# Altium project ZynTra.PrjPcb (part 1 of 2)
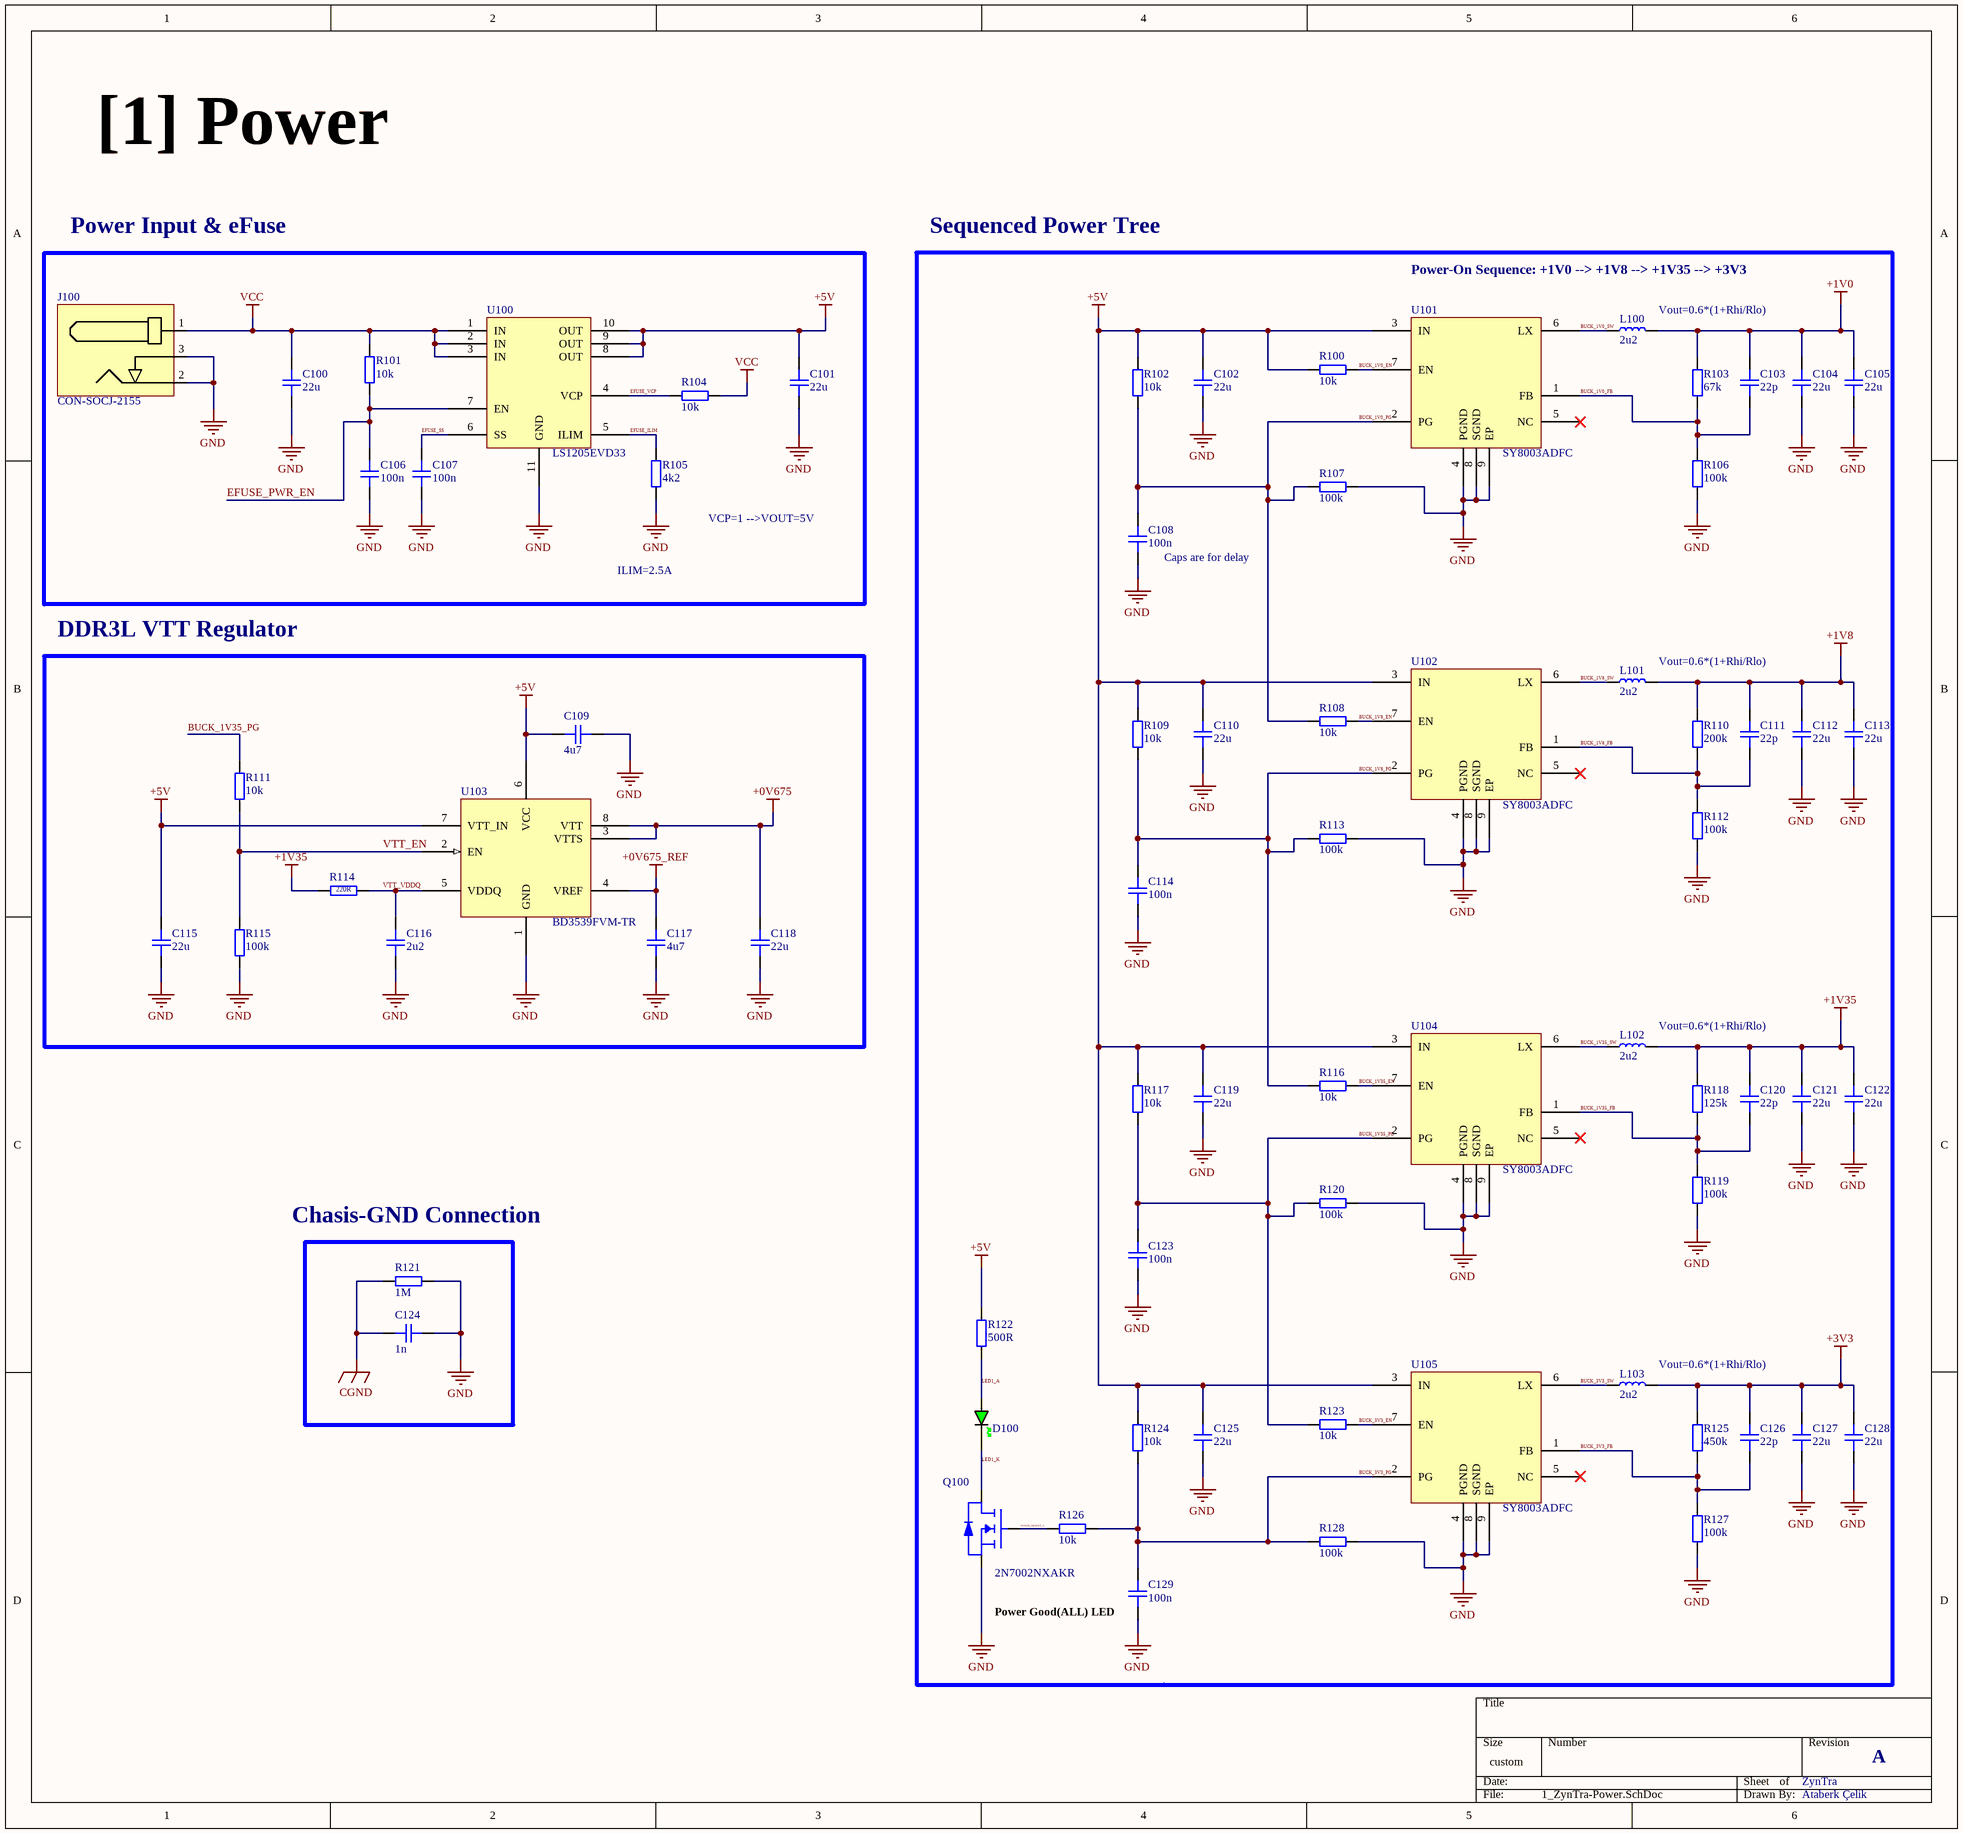
[diagram p0: 1_ZynTra-Power.SchDoc]
10 sheets, 406 parts. Net scope: global (net labels, ports and power ports of the same name join across sheets).
Board file: ZynTra-PCB.PcbDoc
Sheets:
  1_ZynTra-Power.SchDoc
  2_ZynTra-Zynq-Power.SchDoc
  3_ZynTra-Zynq-Config.SchDoc
  4_ZynTra-Zynq-PS.SchDoc
  5_ZynTra-Zynq-PL.SchDoc
  6_ZynTra-Zynq-DDR Interface.SchDoc
  7_ZynTra-DDR3L Modules.SchDoc
  8_Zyntra-Ethernet.SchDoc
  9_ZynTra-USB2.0.SchDoc
  10_ZynTra-Connectors.SchDoc

## Sheet 1_ZynTra-Power.SchDoc
size 381 x 355 mm; DocumentNumber: 1; SheetNumber: 1; SheetTotal: 10

### Parts
C100  22u  [CAP_1206]
C101  22u  [CAP_1206]
C102  22u  [CAP_1206]
C103  22p  [CAP_0201]
C104  22u  [CAP_1206]
C105  22u  [CAP_1206]
C106  100n  [CAP_0402]
C107  100n  [CAP_0402]
C108  100n  [CAP_0402]
C109  4u7  [CAP_0402]
C110  22u  [CAP_1206]
C111  22p  [CAP_0201]
C112  22u  [CAP_1206]
C113  22u  [CAP_1206]
C114  100n  [CAP_0402]
C115  22u  [CAP_1206]
C116  2u2  [CAP_0402]
C117  4u7  [CAP_0402]
C118  22u  [CAP_1206]
C119  22u  [CAP_1206]
C120  22p  [CAP_0201]
C121  22u  [CAP_1206]
C122  22u  [CAP_1206]
C123  100n  [CAP_0402]
C124  1n  [CAP_1206]
C125  22u  [CAP_1206]
C126  22p  [CAP_0201]
C127  22u  [CAP_1206]
C128  22u  [CAP_1206]
C129  100n  [CAP_0402]
D100  GREEN  [LED_0603_GREEN]  (value not drawn)
J100  CON-SOCJ-2155  [CON-SOCJ-2155]
L100  2u2  [SRP0415]
L101  2u2  [SRP0415]
L102  2u2  [SRP0415]
L103  2u2  [SRP0415]
Q100  2N7002NXAKR  [SSM3J338R,LF-SOT23-F]
R100  10k  [RES_0402]
R101  10k  [RES_0402]
R102  10k  [RES_0402]
R103  67k  [RES_0402]
R104  10k  [RES_0402]
R105  4k2  [RES_0402]
R106  100k  [RES_0402]
R107  100k  [RES_0402]
R108  10k  [RES_0402]
R109  10k  [RES_0402]
R110  200k  [RES_0402]
R111  10k  [RES_0402]
R112  100k  [RES_0402]
R113  100k  [RES_0402]
R114  220R  [RES_0402]
R115  100k  [RES_0402]
R116  10k  [RES_0402]
R117  10k  [RES_0402]
R118  125k  [RES_0402]
R119  100k  [RES_0402]
R120  100k  [RES_0402]
R121  1M  [RES_1206]
R122  500R  [RES_0402]
R123  10k  [RES_0402]
R124  10k  [RES_0402]
R125  450k  [RES_0402]
R126  10k  [RES_0402]
R127  100k  [RES_0402]
R128  100k  [RES_0402]
U100  LS1205EVD33  [DFN3x3_10L]
U101  SY8003ADFC  [DFN2x2-8]
U102  SY8003ADFC  [DFN2x2-8]
U103  BD3539FVM-TR  [MSOP-8, 4x2.9mm]
U104  SY8003ADFC  [DFN2x2-8]
U105  SY8003ADFC  [DFN2x2-8]

### Blocks framed on the sheet
Power Input & eFuse: C100 C101 C106 C107 J100 R101 R104 R105 U100
Sequenced Power Tree: C102-C105 C108 C110-C114 C119-C123 C125-C129 D100 L100-L103 Q100 R100 R102 R103 R106-R110 R112 R113 R116-R120 R122-R128 U101 U102 U104 U105
DDR3L VTT Regulator: C109 C115-C118 R111 R114 R115 U103

### Nets
+0V675: C118.2 U103.3(VTTS) U103.8(VTT)
+0V675_REF: C117.2 U103.4(VREF)
+1V0: C103.2 C104.2 C105.2 L100.2 R103.1
+1V8: C111.2 C112.2 C113.2 L101.2 R110.1
+1V35: C120.2 C121.2 C122.2 L102.2 R114.2 R118.1
+3V3: C126.2 C127.2 C128.2 L103.2 R125.1
+5V: C101.2 C102.2 C109.2 C110.2 C115.2 C119.2 C125.2 R100.2 R102.1 R109.1 R117.1 R122.1 R124.1 U100.8(OUT) U100.9(OUT) U100.10(OUT) U101.3(IN) U102.3(IN) U103.6(VCC) U103.7(VTT_IN) U104.3(IN) U105.3(IN)
CGND: C124.1 R121.1
GND: C100.1 C101.1 C102.1 C104.1 C105.1 C106.1 C107.1 C108.1 C109.1 C110.1 C112.1 C113.1 C114.1 C115.1 C116.1 C117.1 C118.1 C119.1 C121.1 C122.1 C123.1 C124.2 C125.1 C127.1 C128.1 C129.1 J100.2 J100.3 Q100.S R105.1 R106.2 R107.2 R112.2 R113.2 R115.1 R119.2 R120.2 R121.2 R127.2 R128.2 U100.11(GND) U101.4(PGND) U101.8(SGND) U101.9(EP) U102.4(PGND) U102.8(SGND) U102.9(EP) U103.1(GND) U104.4(PGND) U104.8(SGND) U104.9(EP) U105.4(PGND) U105.8(SGND) U105.9(EP)
VCC: C100.2 J100.1 R101.2 R104.1 U100.1(IN) U100.2(IN) U100.3(IN)
BUCK_1V0_EN: R100.1 U101.7(EN)
BUCK_1V0_FB: C103.1 R103.2 R106.1 U101.1(FB)
BUCK_1V0_PG: C108.2 R102.2 R107.1 R108.2 U101.2(PG)
BUCK_1V0_SW: L100.1 U101.6(LX)
BUCK_1V8_EN: R108.1 U102.7(EN)
BUCK_1V8_FB: C111.1 R110.2 R112.1 U102.1(FB)
BUCK_1V8_PG: C114.2 R109.2 R113.1 R116.2 U102.2(PG)
BUCK_1V8_SW: L101.1 U102.6(LX)
BUCK_1V35_EN: R116.1 U104.7(EN)
BUCK_1V35_FB: C120.1 R118.2 R119.1 U104.1(FB)
BUCK_1V35_PG: C123.2 R111.1 R117.2 R120.1 R123.2 U104.2(PG)
BUCK_1V35_SW: L102.1 U104.6(LX)
BUCK_3V3_EN: R123.1 U105.7(EN)
BUCK_3V3_FB: C126.1 R125.2 R127.1 U105.1(FB)
BUCK_3V3_PG: C129.2 R124.2 R126.2 R128.1 U105.2(PG)
BUCK_3V3_SW: L103.1 U105.6(LX)
EFUSE_ILIM: R105.2 U100.5(ILIM)
EFUSE_PWR_EN: C106.2 R101.1 U100.7(EN)
EFUSE_SS: C107.2 U100.6(SS)
EFUSE_VCP: R104.2 U100.4(VCP)
LED1_A: D100.A R122.2
LED1_K: D100.K Q100.D
POWER_MOSFET_G: Q100.G R126.1
VTT_EN: R111.2 R115.2 U103.2(EN)
VTT_VDDQ: C116.2 R114.1 U103.5(VDDQ)

Not connected (* = marked no-connect by the designer): U101 5(NC)*; U102 5(NC)*; U104 5(NC)*; U105 5(NC)*

### Notes on the sheet
- [1] Power
- Power-On Sequence: +1V0 --> +1V8 --> +1V35 --> +3V3
- (near L100) Vout=0.6*(1+Rhi/Rlo)
- VCP=1 -->VOUT=5V
- ILIM=2.5A
- (near C108) Caps are for delay
- (near L101) Vout=0.6*(1+Rhi/Rlo)
- (near L102) Vout=0.6*(1+Rhi/Rlo)
- Chasis-GND Connection
- (near L103) Vout=0.6*(1+Rhi/Rlo)
- (near C129) Power Good(ALL) LED
- ZynTra
- A
- Ataberk Çelik

### Library data of the parts
C100-C102 C104 C105 C110 C112 C113 C115 C118 C119 C121 C122 C124 C125 C127 C128 = CAP_1206: Capacitor SMD 1206; Manufacturer: *; Manufacturer Part Number: *; Distributor Link: *; LCSC: *; Rating: *; Dielectric: *
C103 C111 C120 C126 = CAP_0201: Capacitor SMD 0201; Manufacturer: *; Manufacturer Part Number: *; Distributor Link: *; LCSC: *; Rating: *; Dielectric: *
C106-C109 C114 C116 C117 C123 C129 = CAP_0402: Capacitor SMD 0402; Manufacturer: *; Manufacturer Part Number: *; Distributor Link: *; LCSC: *; Rating: *; Dielectric: *
D100 = LED_0603_GREEN: LED 0603 GREEN SMD
J100 = CON-SOCJ-2155: DC Barrell Jack 2.1mm 30V 2.5A THT; Manufacturer: Gravitech; Manufacturer Part Number: CON-SOCJ-2155
L100-L103 = SRP0415-2R2K: Inductor SMD 2.2uH Bourns SRP0415-2R2K; Manufacturer: Bourns; Manufacturer Part Number: SRP0415-2R2K
Q100 = 2N7002NXAKR: MOSFET N-Channel Vds=60V Id=300mA with ESD Protection; Manufacturer: Nexperia; Manufacturer Part Number: 2N7002NXAKR
R100-R120 R122-R128 = RES_0402: Resistor SMD 0402; Manufacturer: *; Manufacturer Part Number: *; Distributor Link: *; LCSC: *
R121 = RES_1206: Resistor SMD 1206; Manufacturer: *; Manufacturer Part Number: *; Distributor Link: *; LCSC: *
U100 = LS1205EVD33: 18V, 5A eFuse with Programmable Current Limit and Output Voltage Clamp; Manufacturer: Littelfuse; Manufacturer Part Number: LS1205EVD33; Supplier Link: https://www.mouser.com.tr/ProductDetail/Littelfuse/LS1205EVD33?qs=4ASt3YYao0VRtislHe5uQQ%3D%3D
U101 U102 U104 U105 = SY8003ADFC: High Efficiency 5.5V, 3A continuous, 1MHz / Synchronous Step Down Regulator; Manufacturer: Silergy; Manufacturer Part Number: SY8003ADFC; Supplier Link: https://www.lcsc.com/product-detail/C178236.html
U103 = BD3539FVM-TR: 1.0V to 5.5V, 1A 1ch / Termination Regulators for DDR-SDRAMs; Manufacturer: ROHM Semiconductor; Manufacturer Part Number: BD3539FVM-TR; Supplier Link: https://www.mouser.com.tr/ProductDetail/ROHM-Semiconductor/BD3539FVM-TR?qs=IsRgwgmxh6%252BQFw%252BWQZBMCg%3D%3D

## Sheet 2_ZynTra-Zynq-Power.SchDoc
size 457 x 279 mm; DocumentNumber: 3; SheetNumber: 2; SheetTotal: 10
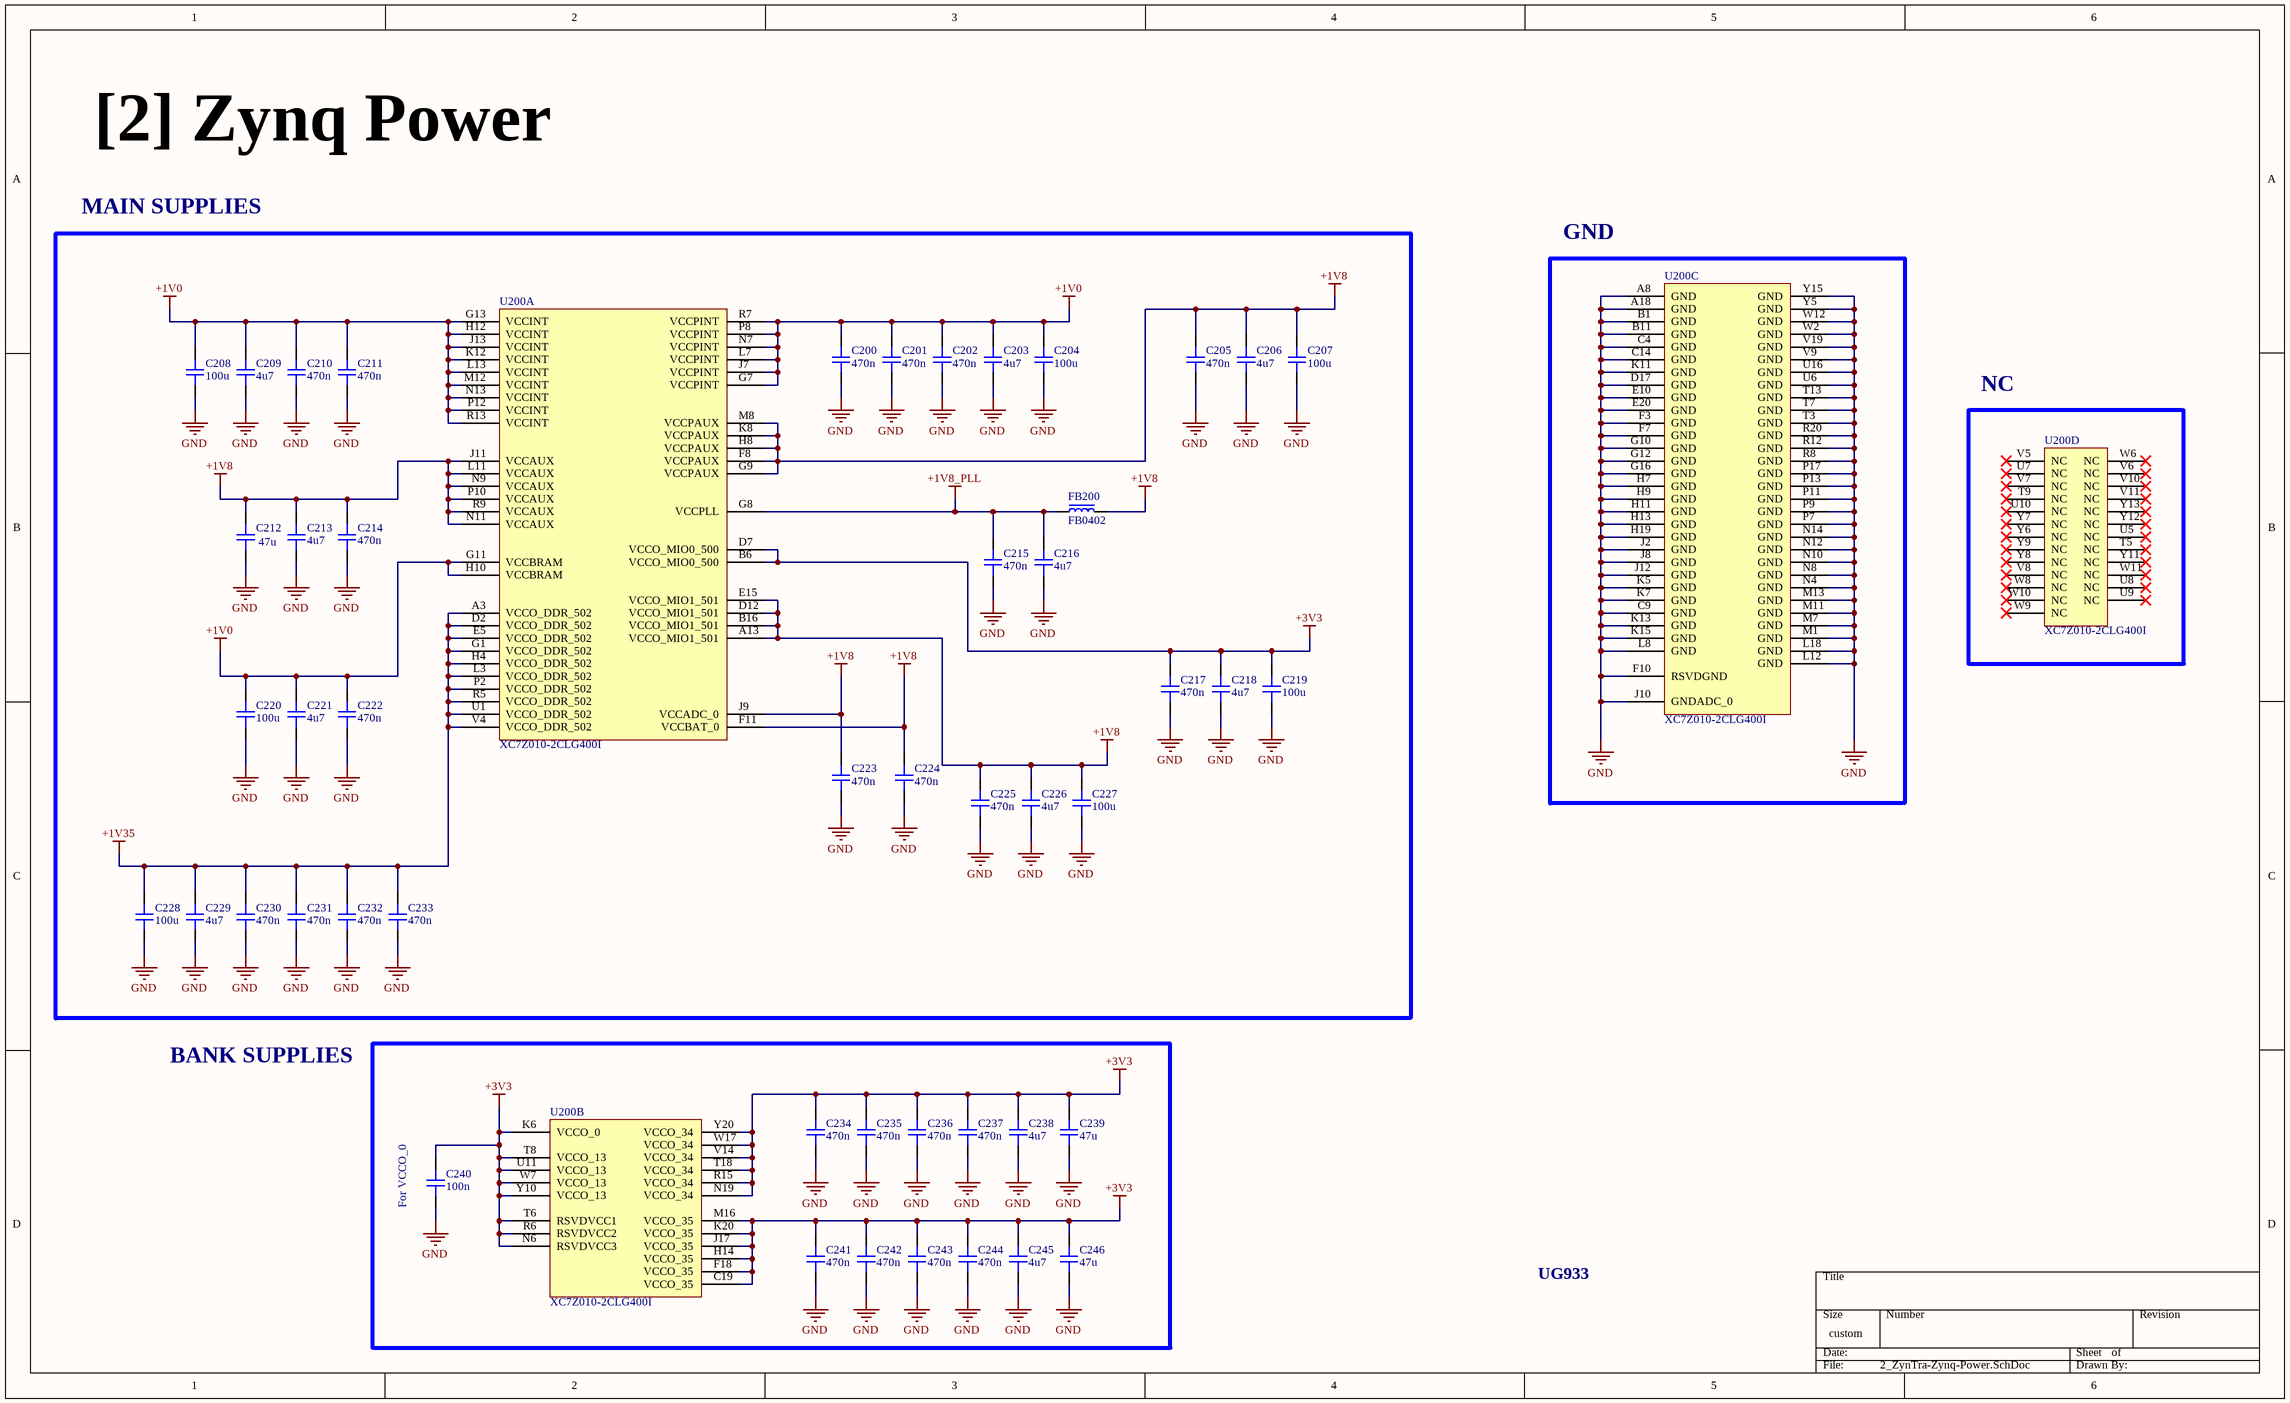
[diagram p1: 2_ZynTra-Zynq-Power.SchDoc]

### Parts
C200  470n  [CAP_0201]
C201  470n  [CAP_0201]
C202  470n  [CAP_0201]
C203  4u7  [CAP_0402]
C204  100u  [CAP_1206]
C205  470n  [CAP_0201]
C206  4u7  [CAP_0402]
C207  100u  [CAP_1206]
C208  100u  [CAP_1206]
C209  4u7  [CAP_0402]
C210  470n  [CAP_0201]
C211  470n  [CAP_0201]
C212  47u  [CAP_1206]
C213  4u7  [CAP_0402]
C214  470n  [CAP_0201]
C215  470n  [CAP_0201]
C216  4u7  [CAP_0402]
C217  470n  [CAP_0201]
C218  4u7  [CAP_0402]
C219  100u  [CAP_1206]
C220  100u  [CAP_1206]
C221  4u7  [CAP_0402]
C222  470n  [CAP_0201]
C223  470n  [CAP_0201]
C224  470n  [CAP_0201]
C225  470n  [CAP_0201]
C226  4u7  [CAP_0402]
C227  100u  [CAP_1206]
C228  100u  [CAP_1206]
C229  4u7  [CAP_0402]
C230  470n  [CAP_0201]
C231  470n  [CAP_0201]
C232  470n  [CAP_0201]
C233  470n  [CAP_0201]
C234  470n  [CAP_0201]
C235  470n  [CAP_0201]
C236  470n  [CAP_0201]
C237  470n  [CAP_0201]
C238  4u7  [CAP_0402]
C239  47u  [CAP_1206]
C240  100n  [CAP_0201]
C241  470n  [CAP_0201]
C242  470n  [CAP_0201]
C243  470n  [CAP_0201]
C244  470n  [CAP_0201]
C245  4u7  [CAP_0402]
C246  47u  [CAP_1206]
FB200  FB0402  [FB_0402]
U200  XC7Z010-2CLG400I  [CLG400, 0.8mm, 17x17]  (parts A,B,C,D of 9)

### Blocks framed on the sheet
MAIN SUPPLIES: C200-C233 FB200 U200
GND: U200
NC: U200
For VCCO_0: C234-C246 U200

### Nets
+1V0: C200.2 C201.2 C202.2 C203.2 C204.2 C208.2 C209.2 C210.2 C211.2 C220.2 C221.2 C222.2 U200.G7(VCCPINT) U200.G11(VCCBRAM) U200.G13(VCCINT) U200.H10(VCCBRAM) U200.H12(VCCINT) U200.J7(VCCPINT) U200.J13(VCCINT) U200.K12(VCCINT) U200.L7(VCCPINT) U200.L13(VCCINT) U200.M12(VCCINT) U200.N7(VCCPINT) U200.N13(VCCINT) U200.P8(VCCPINT) U200.P12(VCCINT) U200.R7(VCCPINT) U200.R13(VCCINT)
+1V8: C205.2 C206.2 C207.2 C212.2 C213.2 C214.2 C223.2 C224.2 C225.2 C226.2 C227.2 FB200.2 U200.A13(VCCO_MIO1_501) U200.B16(VCCO_MIO1_501) U200.D12(VCCO_MIO1_501) U200.E15(VCCO_MIO1_501) U200.F8(VCCPAUX) U200.F11(VCCBAT_0) U200.G9(VCCPAUX) U200.H8(VCCPAUX) U200.J9(VCCADC_0) U200.J11(VCCAUX) U200.K8(VCCPAUX) U200.L11(VCCAUX) U200.M8(VCCPAUX) U200.N9(VCCAUX) U200.N11(VCCAUX) U200.P10(VCCAUX) U200.R9(VCCAUX)
+1V8_PLL: C215.2 C216.2 FB200.1 U200.G8(VCCPLL)
+1V35: C228.2 C229.2 C230.2 C231.2 C232.2 C233.2 U200.A3(VCCO_DDR_502) U200.D2(VCCO_DDR_502) U200.E5(VCCO_DDR_502) U200.G1(VCCO_DDR_502) U200.H4(VCCO_DDR_502) U200.L3(VCCO_DDR_502) U200.P2(VCCO_DDR_502) U200.R5(VCCO_DDR_502) U200.U1(VCCO_DDR_502) U200.V4(VCCO_DDR_502)
+3V3: C217.2 C218.2 C219.2 C234.2 C235.2 C236.2 C237.2 C238.2 C239.2 C240.2 C241.2 C242.2 C243.2 C244.2 C245.2 C246.2 U200.B6(VCCO_MIO0_500) U200.C19(VCCO_35) U200.D7(VCCO_MIO0_500) U200.F18(VCCO_35) U200.H14(VCCO_35) U200.J17(VCCO_35) U200.K6(VCCO_0) U200.K20(VCCO_35) U200.M16(VCCO_35) U200.N6(RSVDVCC3) U200.N19(VCCO_34) U200.R6(RSVDVCC2) U200.R15(VCCO_34) U200.T6(RSVDVCC1) U200.T8(VCCO_13) U200.T18(VCCO_34) U200.U11(VCCO_13) U200.V14(VCCO_34) U200.W7(VCCO_13) U200.W17(VCCO_34) U200.Y10(VCCO_13) U200.Y20(VCCO_34)
GND: C200.1 C201.1 C202.1 C203.1 C204.1 C205.1 C206.1 C207.1 C208.1 C209.1 C210.1 C211.1 C212.1 C213.1 C214.1 C215.1 C216.1 C217.1 C218.1 C219.1 C220.1 C221.1 C222.1 C223.1 C224.1 C225.1 C226.1 C227.1 C228.1 C229.1 C230.1 C231.1 C232.1 C233.1 C234.1 C235.1 C236.1 C237.1 C238.1 C239.1 C240.1 C241.1 C242.1 C243.1 C244.1 C245.1 C246.1 U200.A8(GND) U200.A18(GND) U200.B1(GND) U200.B11(GND) U200.C4(GND) U200.C9(GND) U200.C14(GND) U200.D17(GND) U200.E10(GND) U200.E20(GND) U200.F3(GND) U200.F7(GND) U200.F10(RSVDGND) U200.G10(GND) U200.G12(GND) U200.G16(GND) U200.H7(GND) U200.H9(GND) U200.H11(GND) U200.H13(GND) U200.H19(GND) U200.J2(GND) U200.J8(GND) U200.J10(GNDADC_0) U200.J12(GND) U200.K5(GND) U200.K7(GND) U200.K11(GND) U200.K13(GND) U200.K15(GND) U200.L8(GND) U200.L12(GND) U200.L18(GND) U200.M1(GND) U200.M7(GND) U200.M11(GND) U200.M13(GND) U200.N4(GND) U200.N8(GND) U200.N10(GND) U200.N12(GND) U200.N14(GND) U200.P7(GND) U200.P9(GND) U200.P11(GND) U200.P13(GND) U200.P17(GND) U200.R8(GND) U200.R12(GND) U200.R20(GND) U200.T3(GND) U200.T7(GND) U200.T13(GND) U200.U6(GND) U200.U16(GND) U200.V9(GND) U200.V19(GND) U200.W2(GND) U200.W12(GND) U200.Y5(GND) U200.Y15(GND)

Not connected (* = marked no-connect by the designer): U200 T5(NC)* T9(NC)* U5(NC)* U7(NC)* U8(NC)* U9(NC)* U10(NC)* V5(NC)* V6(NC)* V7(NC)* V8(NC)* V10(NC)* V11(NC)* W6(NC)* W8(NC)* W9(NC)* W10(NC)* W11(NC)* Y6(NC)* Y7(NC)* Y8(NC)* Y9(NC)* Y11(NC)* Y12(NC)* Y13(NC)*

### Notes on the sheet
- [2] Zynq Power
- BANK SUPPLIES
- UG933

### Library data of the parts
C200-C202 C205 C210 C211 C214 C215 C217 C222-C225 C230-C237 C240-C244 = CAP_0201: Capacitor SMD 0201; Manufacturer: *; Manufacturer Part Number: *; Distributor Link: *; LCSC: *; Rating: *; Dielectric: *
C203 C206 C209 C213 C216 C218 C221 C226 C229 C238 C245 = CAP_0402: Capacitor SMD 0402; Manufacturer: *; Manufacturer Part Number: *; Distributor Link: *; LCSC: *; Rating: *; Dielectric: *
C204 C207 C208 C212 C219 C220 C227 C228 C239 C246 = CAP_1206: Capacitor SMD 1206; Manufacturer: *; Manufacturer Part Number: *; Distributor Link: *; LCSC: *; Rating: *; Dielectric: *
FB200 = FB_0402: Ferrite Bead SMD 0402; Manufacturer: *; Manufacturer Part Number: *; Distributor Link: *; LCSC: *
U200 = XC7Z010-2CLG400I: Zynq 7000S SoC devices feature a single-core Arm® Cortex®-A9 processor mated with 28 nm AMD Artix™ 7 based programmable logic, representing a low cost entry point to the scalable Zynq 7000 platform. Available with 6.25 Gb/s transceivers and outfitted with commonly used hardened peripherals, the Zynq 7000S delivers cost-optimized system integration ideal for industrial IoT applications such as motor control and embedded vision.; Manufacturer: AMD / Xilinx; Manufacturer Part Number: XC7Z010-2CLG400I; Supplier Link: https://www.mouser.com.tr/ProductDetail/AMD-Xilinx/XC7Z010-2CLG400I?qs=rrS6PyfT74cETvLeyRFHTA%3D%3D

## Sheet 3_ZynTra-Zynq-Config.SchDoc
size 508 x 330 mm; SheetNumber: 3; SheetTotal: 10
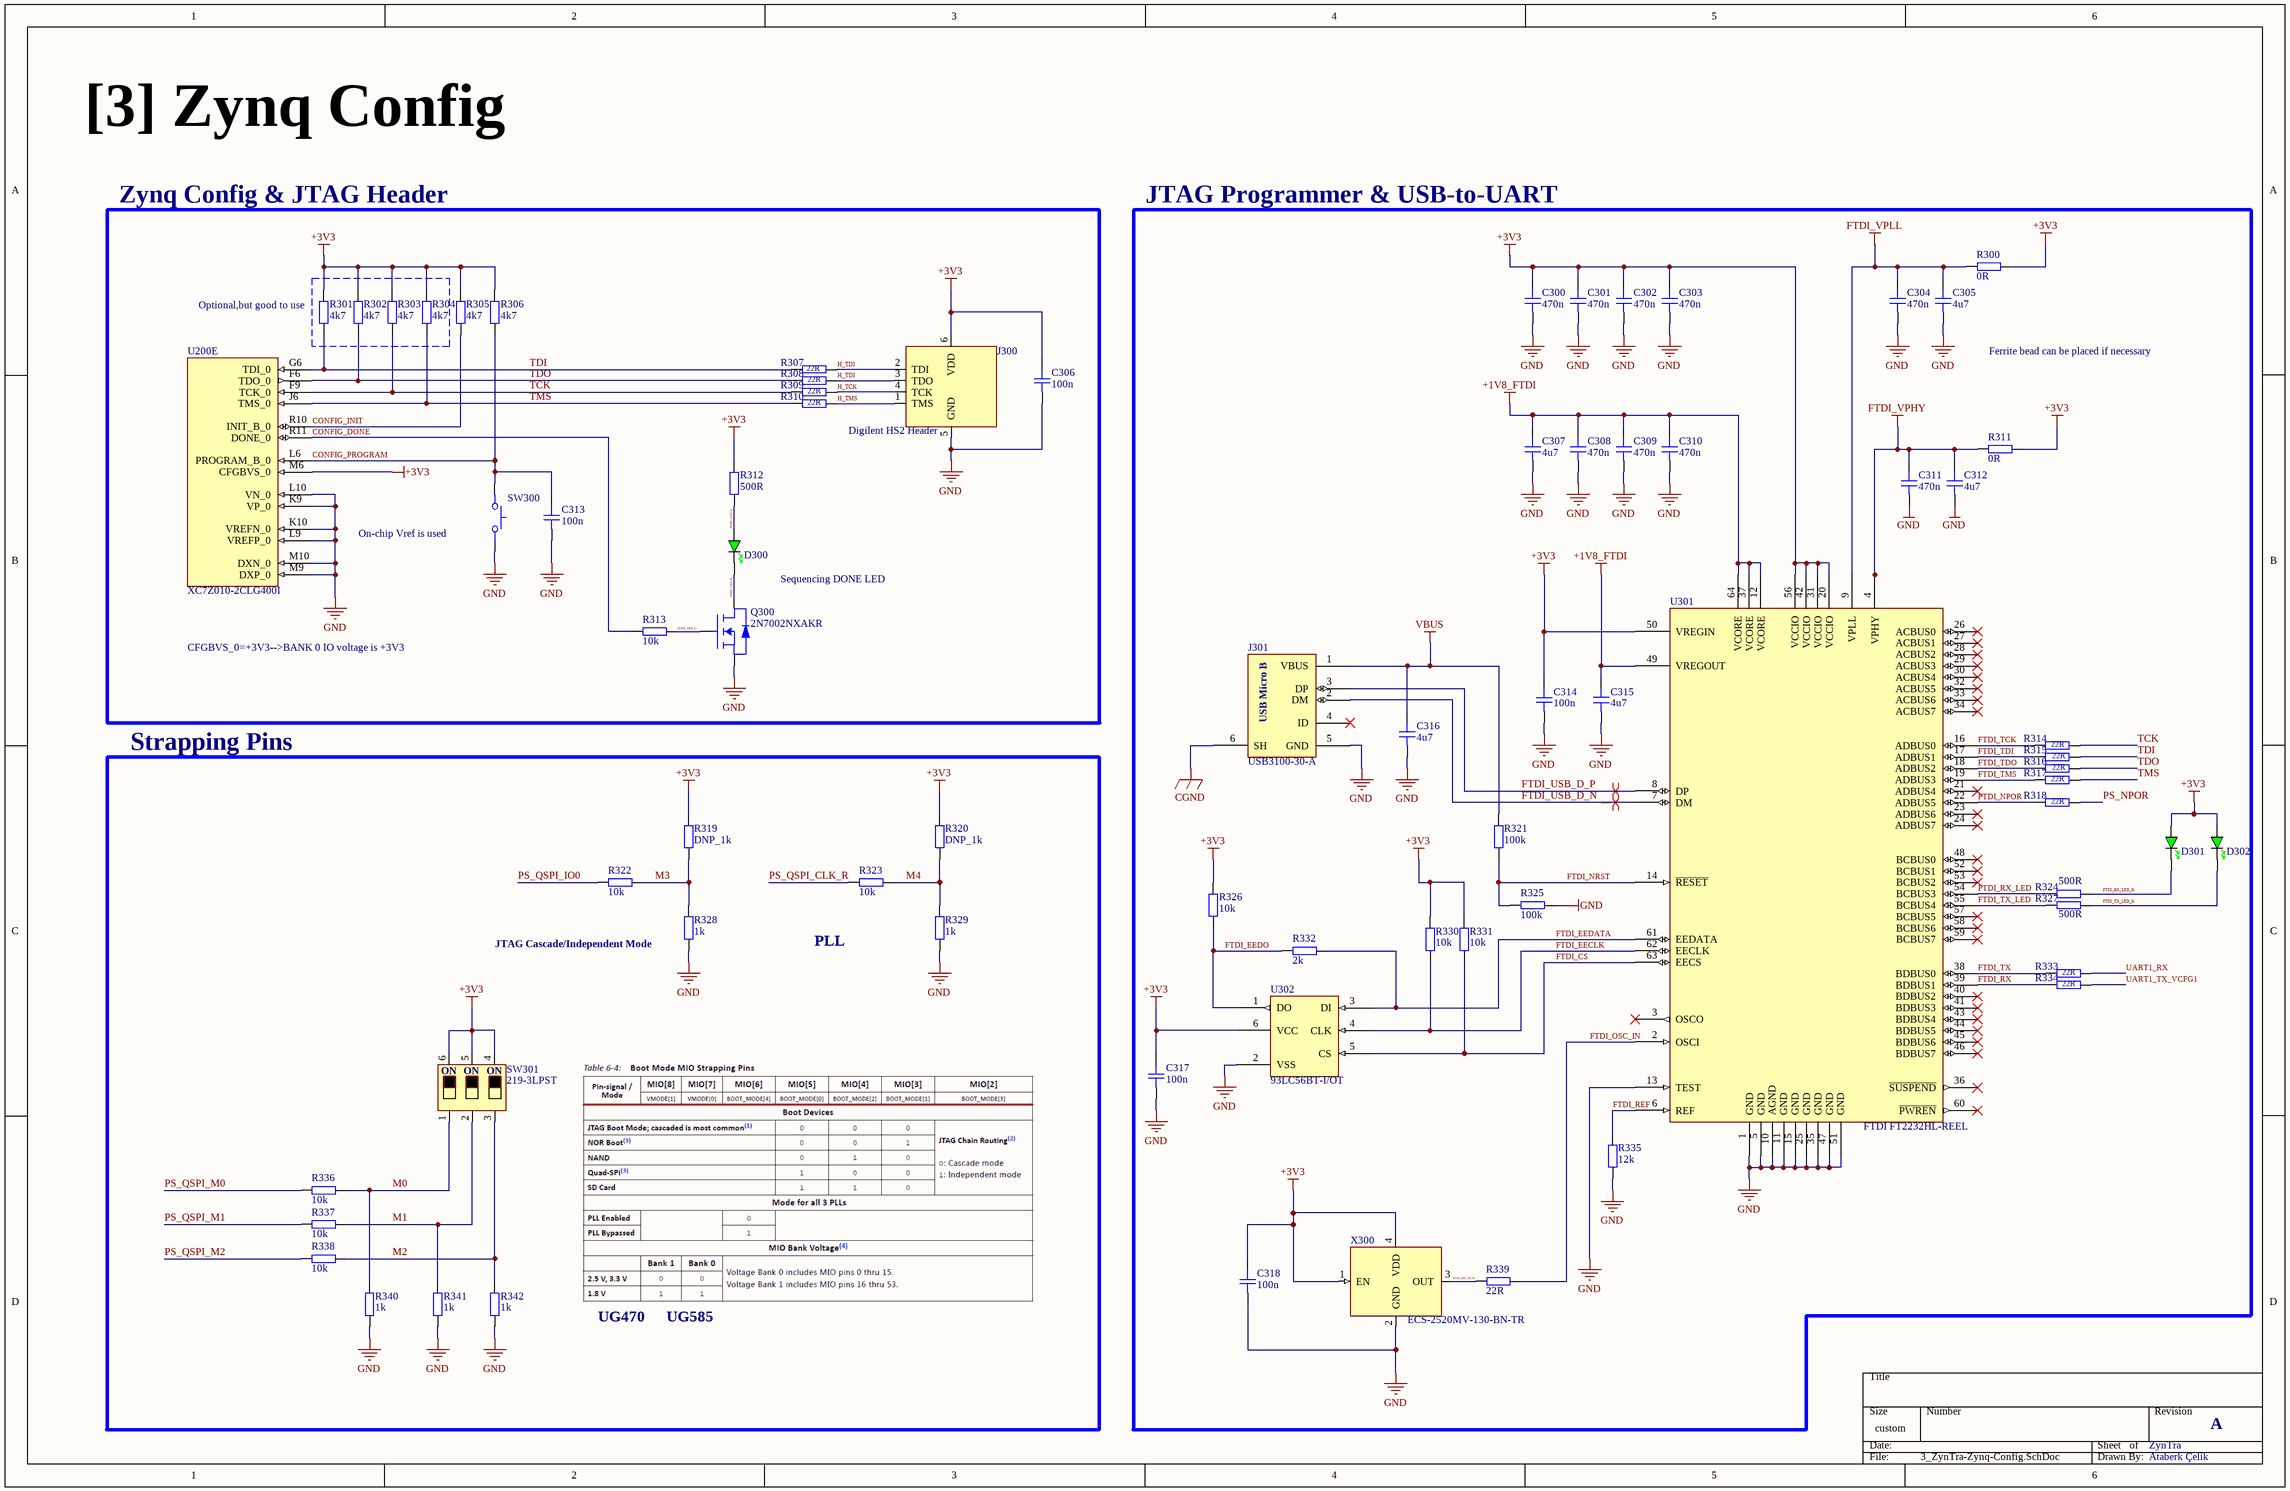
[diagram p2: 3_ZynTra-Zynq-Config.SchDoc]

### Parts
C300  470n  [CAP_0201]
C301  470n  [CAP_0201]
C302  470n  [CAP_0201]
C303  470n  [CAP_0201]
C304  470n  [CAP_0201]
C305  4u7  [CAP_0402]
C306  100n  [CAP_0201]
C307  4u7  [CAP_0402]
C308  470n  [CAP_0201]
C309  470n  [CAP_0201]
C310  470n  [CAP_0201]
C311  470n  [CAP_0201]
C312  4u7  [CAP_0402]
C313  100n  [CAP_0201]
C314  100n  [CAP_0201]
C315  4u7  [CAP_0402]
C316  4u7  [CAP_0402]
C317  100n  [CAP_0201]
C318  100n  [CAP_0201]
D300  GREEN  [LED_0603_GREEN]  (value not drawn)
D301  GREEN  [LED_0603_GREEN]  (value not drawn)
D302  GREEN  [LED_0603_GREEN]  (value not drawn)
J300  Digilent HS2 Header  [DIGILENT_HS2]
J301  USB3100-30-A  [USB3100-30-A]
Q300  2N7002NXAKR  [SSM3J338R,LF-SOT23-F]
R300  0R  [RES_0402]
R301  4k7  [RES_0201]
R302  4k7  [RES_0201]
R303  4k7  [RES_0201]
R304  4k7  [RES_0201]
R305  4k7  [RES_0201]
R306  4k7  [RES_0201]
R307  22R  [RES_0402]
R308  22R  [RES_0402]
R309  22R  [RES_0402]
R310  22R  [RES_0402]
R311  0R  [RES_0402]
R312  500R  [RES_0402]
R313  10k  [RES_0402]
R314  22R  [RES_0402]
R315  22R  [RES_0402]
R316  22R  [RES_0402]
R317  22R  [RES_0402]
R318  22R  [RES_0402]
R319  DNP_1k  [RES_0402]
R320  DNP_1k  [RES_0402]
R321  100k  [RES_0402]
R322  10k  [RES_0402]
R323  10k  [RES_0402]
R324  500R  [RES_0402]
R325  100k  [RES_0402]
R326  10k  [RES_0402]
R327  500R  [RES_0402]
R328  1k  [RES_0402]
R329  1k  [RES_0402]
R330  10k  [RES_0402]
R331  10k  [RES_0402]
R332  2k  [RES_0402]
R333  22R  [RES_0402]
R334  22R  [RES_0402]
R335  12k  [RES_0402]
R336  10k  [RES_0402]
R337  10k  [RES_0402]
R338  10k  [RES_0402]
R339  22R  [RES_0402]
R340  1k  [RES_0402]
R341  1k  [RES_0402]
R342  1k  [RES_0402]
SW300  SKRPANE010  [SKRPANE010]  (value not drawn)
SW301  219-3LPST  [219-3LPST]
U200  XC7Z010-2CLG400I  [CLG400, 0.8mm, 17x17]  (part E of 9)
U301  FTDI FT2232HL-REEL  [LQFP, 64, 12x12mm]
U302  93LC56BT-I/OT  [SOT23-6, 1.60x2.90]
X300  ECS-2520MV-130-BN-TR  [XTAL_2520]

### Blocks framed on the sheet
Zynq Config & JTAG Header: C306 C313 D300 J300 Q300 R301-R310 R312 R313 SW300 U200
JTAG Programmer & USB-to-UART: C300-C305 C307-C312 C314-C318 D301 D302 J301 R300 R311 R314-R318 R321 R324-R327 R330-R335 R339 U301 U302 X300
Strapping Pins: R319 R320 R322 R323 R328 R329 R336-R338 R340-R342 SW301

### Nets
+1V8_FTDI: C307.2 C308.2 C309.2 C310.2 C315.2 U301.12(VCORE) U301.37(VCORE) U301.49(VREGOUT) U301.64(VCORE)
+3V3: C300.2 C301.2 C302.2 C303.2 C306.2 C314.2 C317.2 C318.2 D301.A D302.A J300.6(VDD) R300.2 R301.2 R302.2 R303.2 R304.2 R305.2 R306.2 R311.2 R312.1 R319.2 R320.2 R326.2 R330.2 R331.2 SW301.4 SW301.5 SW301.6 U200.M6(CFGBVS_0) U301.20(VCCIO) U301.31(VCCIO) U301.42(VCCIO) U301.50(VREGIN) U301.56(VCCIO) U302.6(VCC) X300.1(EN) X300.4(VDD)
CGND: J301.6(SH)
FTDI_VPHY: C311.2 C312.2 R311.1 U301.4(VPHY)
FTDI_VPLL: C304.2 C305.2 R300.1 U301.9(VPLL)
GND: C300.1 C301.1 C302.1 C303.1 C304.1 C305.1 C306.1 C307.1 C308.1 C309.1 C310.1 C311.1 C312.1 C313.1 C314.1 C315.1 C316.1 C317.1 C318.1 J300.5(GND) J301.5(GND) Q300.S R325.1 R328.1 R329.1 R335.1 R340.1 R341.1 R342.1 SW300.34 U200.K9(VP_0) U200.K10(VREFN_0) U200.L9(VREFP_0) U200.L10(VN_0) U200.M9(DXP_0) U200.M10(DXN_0) U301.1(GND) U301.5(GND) U301.10(AGND) U301.11(GND) U301.13(TEST) U301.15(GND) U301.25(GND) U301.35(GND) U301.47(GND) U301.51(GND) U302.2(VSS) X300.2(GND)
VBUS: C316.2 J301.1(VBUS) R321.2
CONFIG_DONE: R313.1 U200.R11(DONE_0)
CONFIG_INIT: R305.1 U200.R10(INIT_B_0)
CONFIG_PROGRAM: C313.2 R306.1 SW300.12 U200.L6(PROGRAM_B_0)
DONE_LED_A: D300.A R312.2
DONE_LED_K: D300.K Q300.D
DONE_MOS_G: Q300.G R313.2
FTDI_CS: R331.1 U301.63(EECS) U302.5(CS)
FTDI_EECLK: R330.1 U301.62(EECLK) U302.4(CLK)
FTDI_EEDATA: R332.1 U301.61(EEDATA) U302.3(DI)
FTDI_EEDO: R326.1 R332.2 U302.1(DO)
FTDI_NPOR: R318.2 U301.22(ADBUS5)
FTDI_NRST: R321.1 R325.2 U301.14(~{RESET})
FTDI_OSC_IN: R339.1 U301.2(OSCI)
FTDI_OSC_IN_R: R339.2 X300.3(OUT)
FTDI_REF: R335.2 U301.6(REF)
FTDI_RX: R334.2 U301.39(BDBUS1)
FTDI_RX_LED: R324.2 U301.54(BCBUS3)
FTDI_RX_LED_K: D301.K R324.1
FTDI_TCK: R314.2 U301.16(ADBUS0)
FTDI_TDI: R315.2 U301.17(ADBUS1)
FTDI_TDO: R316.2 U301.18(ADBUS2)
FTDI_TMS: R317.2 U301.19(ADBUS3)
FTDI_TX: R333.2 U301.38(BDBUS0)
FTDI_TX_LED: R327.2 U301.55(BCBUS4)
FTDI_TX_LED_K: D302.K R327.1
FTDI_USB_D_N: J301.2(DM) U301.7(DM)
FTDI_USB_D_P: J301.3(DP) U301.8(DP)
H_TCK: J300.4(TCK) R309.2
H_TDI: J300.2(TDI) J300.3(TDO) R307.2 R308.2
H_TMS: J300.1(TMS) R310.2
M0: R336.2 R340.2 SW301.1
M1: R337.2 R341.2 SW301.2
M2: R338.2 R342.2 SW301.3
M3: R319.1 R322.2 R328.2
M4: R320.1 R323.2 R329.2
PS_NPOR: R318.1
PS_QSPI_CLK_R: R323.1
PS_QSPI_IO0: R322.1
PS_QSPI_M0: R336.1
PS_QSPI_M1: R337.1
PS_QSPI_M2: R338.1
TCK: R303.1 R309.1 R314.1 U200.F9(TCK_0)
TDI: R301.1 R307.1 R315.1 U200.G6(TDI_0)
TDO: R302.1 R308.1 R316.1 U200.F6(TDO_0)
TMS: R304.1 R310.1 R317.1 U200.J6(TMS_0)
UART1_RX: R333.1
UART1_TX_VCFG1: R334.1

Not connected (* = marked no-connect by the designer): J301 4(ID)*; U301 3(OSCO)* 21(ADBUS4)* 23(ADBUS6)* 24(ADBUS7)* 26(ACBUS0)* 27(ACBUS1)* 28(ACBUS2)* 29(ACBUS3)* 30(ACBUS4)* 32(ACBUS5)* 33(ACBUS6)* 34(ACBUS7)* 36(~{SUSPEND})* 40(BDBUS2)* 41(BDBUS3)* 43(BDBUS4)* 44(BDBUS5)* 45(BDBUS6)* 46(BDBUS7)* 48(BCBUS0)* 52(BCBUS1)* 53(BCBUS2)* 57(BCBUS5)* 58(BCBUS6)* 59(BCBUS7)* 60(~{PWREN})*

### Layout directives
differential pair: FTDI_USB_D_N, FTDI_USB_D_P

### Notes on the sheet
- [3] Zynq Config
- (near R301) Optional,but good to use
- Ferrite bead can be placed if necessary
- (near SW300) On-chip Vref is used
- Sequencing DONE LED
- CFGBVS_0=+3V3-->BANK 0 IO voltage is +3V3
- JTAG Cascade/Independent Mode
- PLL
- UG470
- UG585
- ZynTra
- A
- Ataberk Çelik
- (in symbol 219-3LPST) ON
- (in symbol USB3100-30-A) USB Micro B

### Library data of the parts
C300-C304 C306 C308-C311 C313 C314 C317 C318 = CAP_0201: Capacitor SMD 0201; Manufacturer: *; Manufacturer Part Number: *; Distributor Link: *; LCSC: *; Rating: *; Dielectric: *
C305 C307 C312 C315 C316 = CAP_0402: Capacitor SMD 0402; Manufacturer: *; Manufacturer Part Number: *; Distributor Link: *; LCSC: *; Rating: *; Dielectric: *
D300-D302 = LED_0603_GREEN: LED 0603 GREEN SMD
J300 = Digilent_HS2_Header: Digilent HS2 6-Pin 2.54mm Pitch Header; Manufacturer: Amphenol FCI; Manufacturer Part Number: 68000-406HLF
J301 = USB3100-30-A: Micro USB Receptacle, Type B, Surface Mount, Horizontal
Q300 = 2N7002NXAKR: as Q100 on sheet 1_ZynTra-Power; Manufacturer Part Number: 2N7002NXAKR
R300 R307-R342 = RES_0402: Resistor SMD 0402; Manufacturer: *; Manufacturer Part Number: *; Distributor Link: *; LCSC: *
R301-R306 = RES_0201: Resistor SMD 0201; Manufacturer: *; Manufacturer Part Number: *; Distributor Link: *; LCSC: *
SW300 = SKRPANE010: Tactile Switch SMD SPST; Manufacturer: Alps Alpine; Manufacturer Part Number: SKRPANE010
SW301 = 219-3LPST: DIP Switches SPST 3x; Manufacturer: CTS; Manufacturer Part Number: 219-3LPST
U200 = XC7Z010-2CLG400I: as U200 on sheet 2_ZynTra-Zynq-Power; Manufacturer Part Number: XC7Z010-2CLG400I; Supplier Link: https://www.mouser.com.tr/ProductDetail/AMD-Xilinx/XC7Z010-2CLG400I?qs=rrS6PyfT74cETvLeyRFHTA%3D%3D
U302 = 93LC56BT-I/OT: 2-Kbit Microwire Compatible Serial EEPROM; Manufacturer: Microchip; Manufacturer Part Number: 93LC56BT-I/OT; Supplier Link: https://www.mouser.com.tr/ProductDetail/Microchip-Technology/93LC56BT-I-OT?qs=lQv0JY93vrc7B5Rh5LPW8g%3D%3D&srsltid=AfmBOoog9BmJ_7H7C7v997_1yIIFw87wkM-Azk-UmBmq9KE1ZdzKQL_v
X300 = ECS-2520MV-130-BN-TR: Standard Clock Oscillators XO (Standard),13MHz,Standby (Power Down),CMOS, Multi-Volt,1.6 V 3.6 V,+/-50ppm,-40 C 85 C,6mA,Surface Mount,4-SMD, No Lead,(2.50mm x 2.00mm),(0.80mm); Manufacturer: ECS; Manufacturer Part Number: ECS-2520MV-130-BN-TR
U301 = FTDI FT2232HL-REEL: Manufacturer: FTDI; Manufacturer Part Number: FT2232HL-REEL; Supplier Link: https://www.lcsc.com/product-detail/C27882.html

## Sheet 4_ZynTra-Zynq-PS.SchDoc
size 457 x 266 mm; SheetNumber: 4; SheetTotal: 10
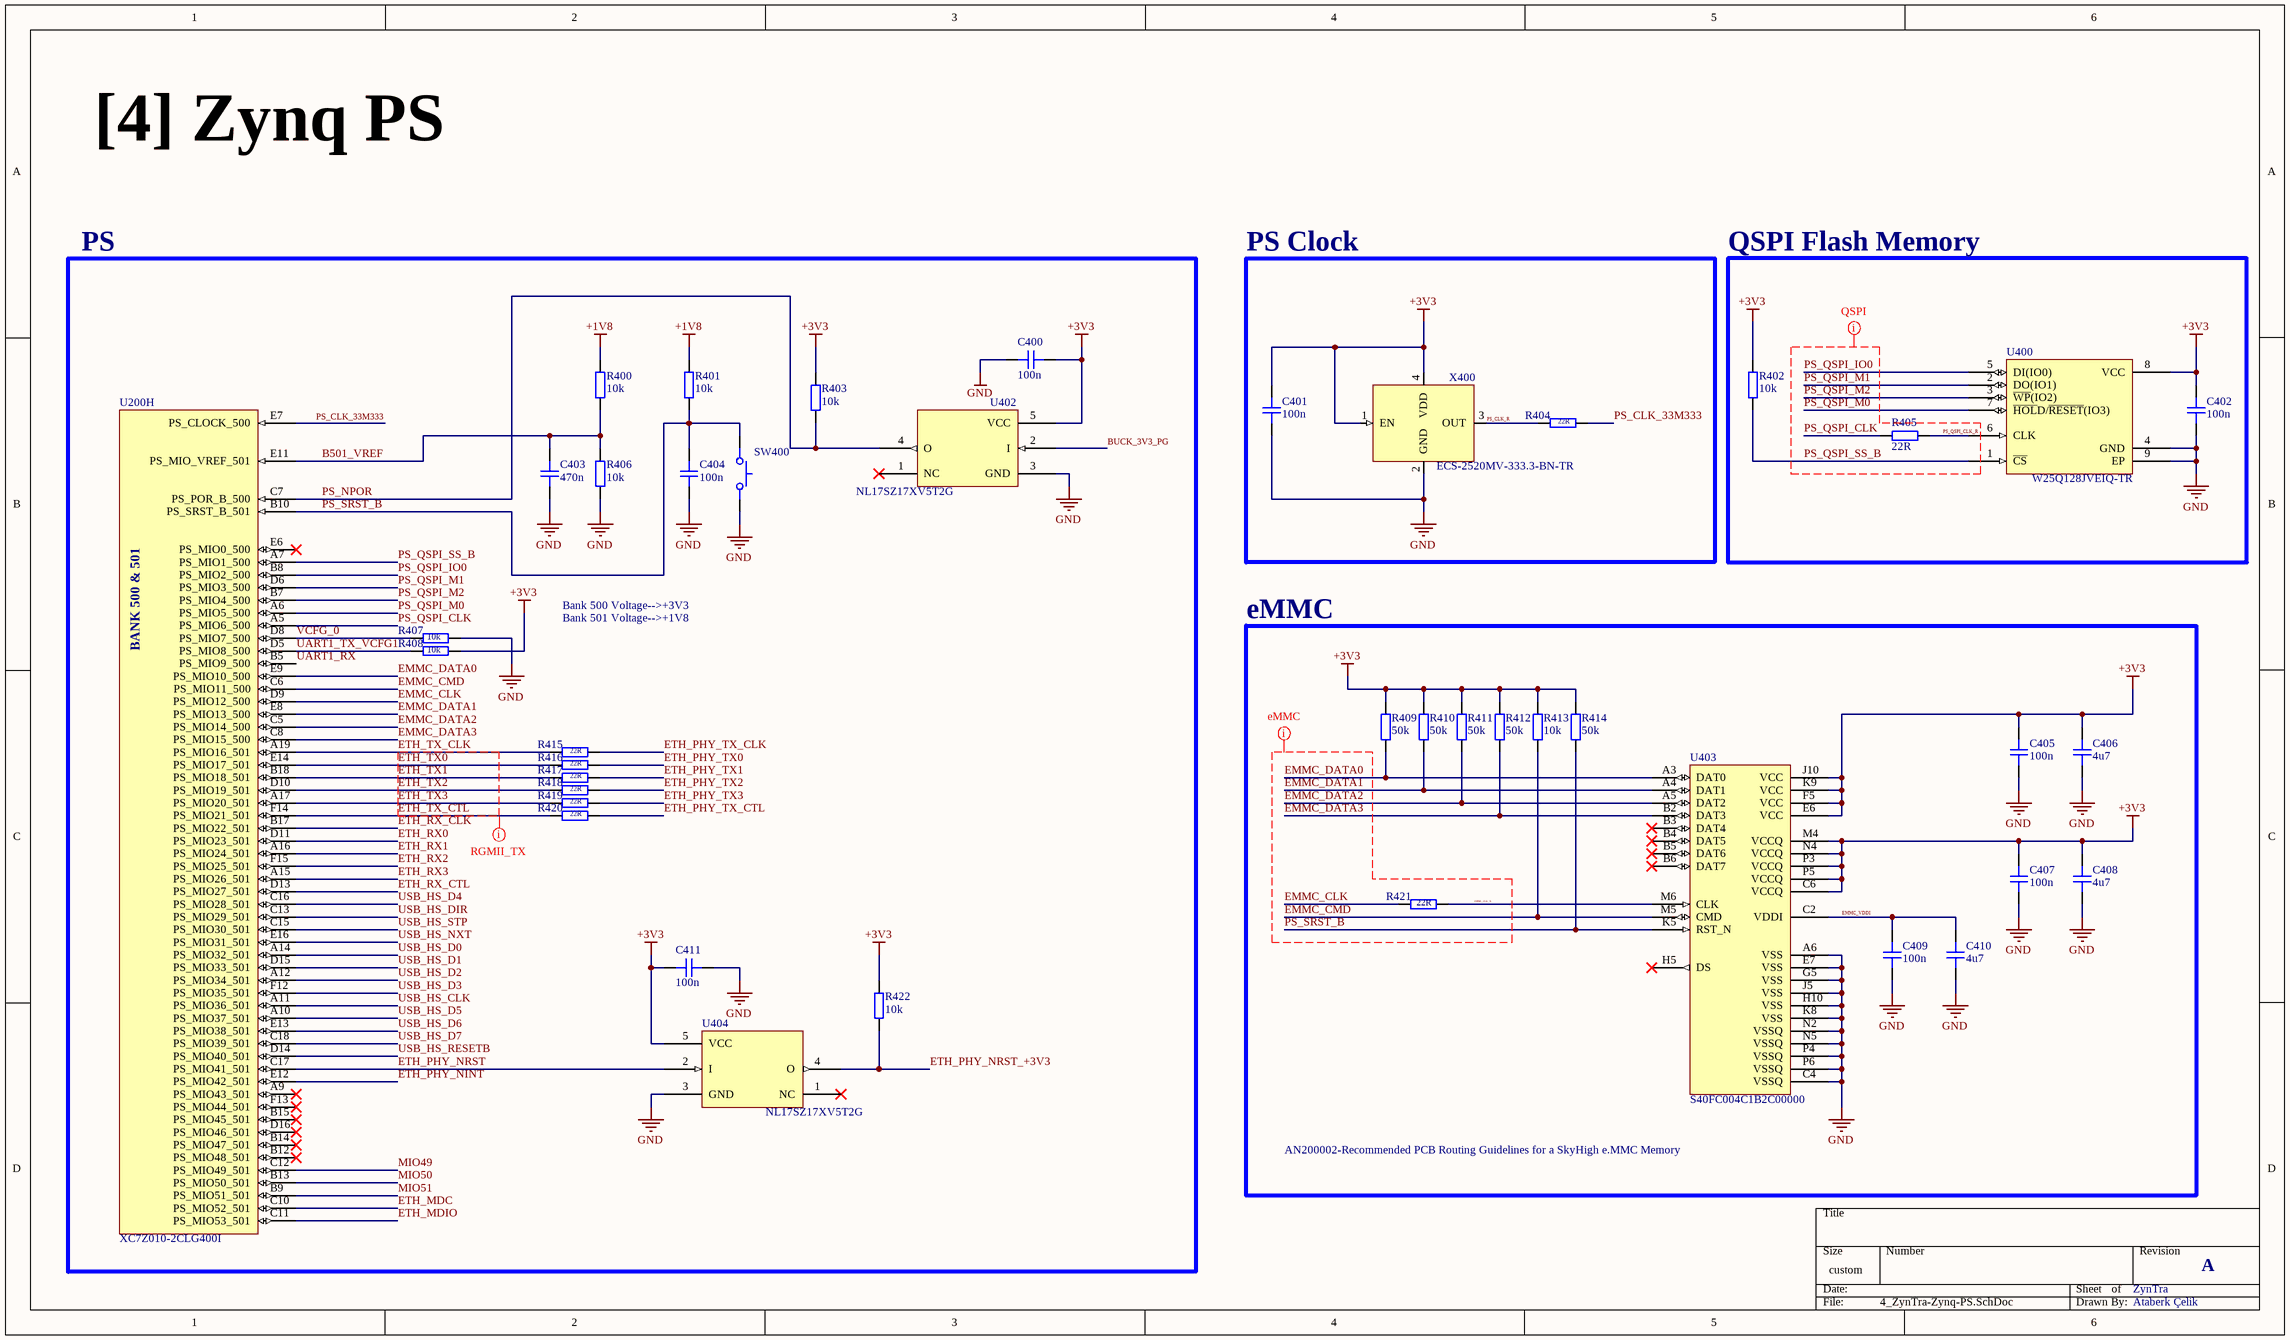
[diagram p3: 4_ZynTra-Zynq-PS.SchDoc]

### Parts
C400  100n  [CAP_0201]
C401  100n  [CAP_0201]
C402  100n  [CAP_0201]
C403  470n  [CAP_0201]
C404  100n  [CAP_0201]
C405  100n  [CAP_0201]
C406  4u7  [CAP_0402]
C407  100n  [CAP_0201]
C408  4u7  [CAP_0402]
C409  100n  [CAP_0201]
C410  4u7  [CAP_0402]
C411  100n  [CAP_0201]
R400  10k  [RES_0402]
R401  10k  [RES_0402]
R402  10k  [RES_0402]
R403  10k  [RES_0402]
R404  22R  [RES_0402]
R405  22R  [RES_0402]
R406  10k  [RES_0402]
R407  10k  [RES_0402]
R408  10k  [RES_0402]
R409  50k  [RES_0402]
R410  50k  [RES_0402]
R411  50k  [RES_0402]
R412  50k  [RES_0402]
R413  10k  [RES_0402]
R414  50k  [RES_0402]
R415  22R  [RES_0402]
R416  22R  [RES_0402]
R417  22R  [RES_0402]
R418  22R  [RES_0402]
R419  22R  [RES_0402]
R420  22R  [RES_0402]
R421  22R  [RES_0402]
R422  10k  [RES_0402]
SW400  SKRPANE010  [SKRPANE010]  (value not drawn)
U200  XC7Z010-2CLG400I  [CLG400, 0.8mm, 17x17]  (part H of 9)
U400  W25Q128JVEIQ-TR  [WSON8, 8x6mm]
U402  NL17SZ17XV5T2G  [SOTFL553, 5 ,1.60x1.20mm]
U403  S40FC004C1B2C00000  [VFBGA-153, 9.00x7.50mm]
U404  NL17SZ17XV5T2G  [SOTFL553, 5 ,1.60x1.20mm]
X400  ECS-2520MV-333.3-BN-TR  [XTAL_2520]

### Blocks framed on the sheet
PS: C400 C403 C404 C411 R400 R401 R403 R406-R408 R415-R420 R422 SW400 U200 U402 U404
PS Clock: C401 R404 X400
QSPI Flash Memory: C402 R402 R405 U400
eMMC: C405-C410 R409-R414 R421 U403

### Nets
+1V8: R400.1 R401.1
+3V3: C400.1 C401.2 C402.1 C405.2 C406.2 C407.2 C408.2 C411.2 R402.1 R403.1 R408.2 R409.1 R410.1 R411.1 R412.1 R413.1 R414.1 R422.1 U400.8(VCC) U402.5(VCC) U403.C6(VCCQ) U403.E6(VCC) U403.F5(VCC) U403.J10(VCC) U403.K9(VCC) U403.M4(VCCQ) U403.N4(VCCQ) U403.P3(VCCQ) U403.P5(VCCQ) U404.5(VCC) X400.1(EN) X400.4(VDD)
GND: C400.2 C401.1 C402.2 C403.1 C404.1 C405.1 C406.1 C407.1 C408.1 C409.1 C410.1 C411.1 R406.2 R407.2 SW400.34 U400.4(GND) U400.9(EP) U402.3(GND) U403.A6(VSS) U403.C4(VSSQ) U403.E7(VSS) U403.G5(VSS) U403.H10(VSS) U403.J5(VSS) U403.K8(VSS) U403.N2(VSSQ) U403.N5(VSSQ) U403.P4(VSSQ) U403.P6(VSSQ) U404.3(GND) X400.2(GND)
B501_VREF: C403.2 R400.2 R406.1 U200.E11(PS_MIO_VREF_501)
BUCK_3V3_PG: U402.2(I)
EMMC_CLK: R421.2 U200.D9(PS_MIO12_500)
EMMC_CLK_R: R421.1 U403.M6(CLK)
EMMC_CMD: R413.2 U200.C6(PS_MIO11_500) U403.M5(CMD)
EMMC_DATA0: R409.2 U200.E9(PS_MIO10_500) U403.A3(DAT0)
EMMC_DATA1: R410.2 U200.E8(PS_MIO13_500) U403.A4(DAT1)
EMMC_DATA2: R411.2 U200.C5(PS_MIO14_500) U403.A5(DAT2)
EMMC_DATA3: R412.2 U200.C8(PS_MIO15_500) U403.B2(DAT3)
EMMC_VDDI: C409.2 C410.2 U403.C2(VDDI)
ETH_MDC: U200.C10(PS_MIO52_501)
ETH_MDIO: U200.C11(PS_MIO53_501)
ETH_PHY_NINT: U200.E12(PS_MIO42_501)
ETH_PHY_NRST: U200.C17(PS_MIO41_501) U404.2(I)
ETH_PHY_NRST_+3V3: R422.2 U404.4(O)
ETH_PHY_TX0: R416.1
ETH_PHY_TX1: R417.1
ETH_PHY_TX2: R418.1
ETH_PHY_TX3: R419.1
ETH_PHY_TX_CLK: R415.1
ETH_PHY_TX_CTL: R420.1
ETH_RX0: U200.D11(PS_MIO23_501)
ETH_RX1: U200.A16(PS_MIO24_501)
ETH_RX2: U200.F15(PS_MIO25_501)
ETH_RX3: U200.A15(PS_MIO26_501)
ETH_RX_CLK: U200.B17(PS_MIO22_501)
ETH_RX_CTL: U200.D13(PS_MIO27_501)
ETH_TX0: R416.2 U200.E14(PS_MIO17_501)
ETH_TX1: R417.2 U200.B18(PS_MIO18_501)
ETH_TX2: R418.2 U200.D10(PS_MIO19_501)
ETH_TX3: R419.2 U200.A17(PS_MIO20_501)
ETH_TX_CLK: R415.2 U200.A19(PS_MIO16_501)
ETH_TX_CTL: R420.2 U200.F14(PS_MIO21_501)
MIO49: U200.C12(PS_MIO49_501)
MIO50: U200.B13(PS_MIO50_501)
MIO51: U200.B9(PS_MIO51_501)
PS_CLK_33M333: R404.1 U200.E7(PS_CLOCK_500)
PS_CLK_R: R404.2 X400.3(OUT)
PS_NPOR: R403.2 U200.C7(PS_POR_B_500) U402.4(O)
PS_QSPI_CLK: R405.2 U200.A5(PS_MIO6_500)
PS_QSPI_CLK_R: R405.1 U400.6(CLK)
PS_QSPI_IO0: U200.B8(PS_MIO2_500) U400.5(DI(IO0))
PS_QSPI_M0: U200.A6(PS_MIO5_500) U400.7(~{HOL}D/~{RESET}(IO3))
PS_QSPI_M1: U200.D6(PS_MIO3_500) U400.2(DO(IO1))
PS_QSPI_M2: U200.B7(PS_MIO4_500) U400.3(~{WP}(IO2))
PS_QSPI_SS_B: R402.2 U200.A7(PS_MIO1_500) U400.1(~{CS})
PS_SRST_B: C404.2 R401.2 R414.2 SW400.12 U200.B10(PS_SRST_B_501) U403.K5(RST_N)
UART1_RX: U200.B5(PS_MIO9_500)
UART1_TX_VCFG1: R408.1 U200.D5(PS_MIO8_500)
USB_HS_CLK: U200.A11(PS_MIO36_501)
USB_HS_D0: U200.A14(PS_MIO32_501)
USB_HS_D1: U200.D15(PS_MIO33_501)
USB_HS_D2: U200.A12(PS_MIO34_501)
USB_HS_D3: U200.F12(PS_MIO35_501)
USB_HS_D4: U200.C16(PS_MIO28_501)
USB_HS_D5: U200.A10(PS_MIO37_501)
USB_HS_D6: U200.E13(PS_MIO38_501)
USB_HS_D7: U200.C18(PS_MIO39_501)
USB_HS_DIR: U200.C13(PS_MIO29_501)
USB_HS_NXT: U200.E16(PS_MIO31_501)
USB_HS_RESETB: U200.D14(PS_MIO40_501)
USB_HS_STP: U200.C15(PS_MIO30_501)
VCFG_0: R407.1 U200.D8(PS_MIO7_500)

Not connected (* = marked no-connect by the designer): U200 A9(PS_MIO43_501)* B12(PS_MIO48_501)* B14(PS_MIO47_501)* B15(PS_MIO45_501)* D16(PS_MIO46_501)* E6(PS_MIO0_500)* F13(PS_MIO44_501)*; U402 1(NC)*; U403 B3(DAT4)* B4(DAT5)* B5(DAT6)* B6(DAT7)* H5(DS)*; U404 1(NC)*

### Layout directives
net class QSPI; rule Matched Net Lengths [Delay Tolerance = 10ps]: PS_QSPI_CLK, PS_QSPI_CLK_R, PS_QSPI_IO0, PS_QSPI_M0, PS_QSPI_M1, PS_QSPI_M2, PS_QSPI_SS_B
net class EMMC; rule Matched Net Lengths [Delay Tolerance = 10ps]: EMMC_CLK, EMMC_CLK_R, EMMC_CMD, EMMC_DATA0, EMMC_DATA1, EMMC_DATA2, EMMC_DATA3, PS_SRST_B
net class RGMII_TX; rule Matched Net Lengths [Delay Tolerance = 1ps]: ETH_TX_CTL

### Notes on the sheet
- [4] Zynq PS
- Bank 500 Voltage-->+3V3
- Bank 501 Voltage-->+1V8
- AN200002-Recommended PCB Routing Guidelines for a SkyHigh e.MMC Memory
- ZynTra
- A
- Ataberk Çelik
- (in symbol XC7Z010-2CLG400I, part H) BANK 500 & 501

### Library data of the parts
C400-C405 C407 C409 C411 = CAP_0201: Capacitor SMD 0201; Manufacturer: *; Manufacturer Part Number: *; Distributor Link: *; LCSC: *; Rating: *; Dielectric: *
C406 C408 C410 = CAP_0402: Capacitor SMD 0402; Manufacturer: *; Manufacturer Part Number: *; Distributor Link: *; LCSC: *; Rating: *; Dielectric: *
R400-R422 = RES_0402: Resistor SMD 0402; Manufacturer: *; Manufacturer Part Number: *; Distributor Link: *; LCSC: *
SW400 = SKRPANE010: as SW300 on sheet 3_ZynTra-Zynq-Config; Manufacturer Part Number: SKRPANE010
U200 = XC7Z010-2CLG400I: as U200 on sheet 2_ZynTra-Zynq-Power; Manufacturer Part Number: XC7Z010-2CLG400I; Supplier Link: https://www.mouser.com.tr/ProductDetail/AMD-Xilinx/XC7Z010-2CLG400I?qs=rrS6PyfT74cETvLeyRFHTA%3D%3D
U400 = W25Q128JVEIQ-TR: 3V 128M-BIT / SERIAL FLASH MEMORY WITH / DUAL/QUAD SPI; Manufacturer: Winbond; Manufacturer Part Number: W25Q128JVEIQ TR; Supplier Link: https://www.lcsc.com/product-detail/C2456297.html?s_z=n_W25Q128JVEIQ-TR&spm=wm.ssy.bg.0.xh&lcsc_vid=TlhdUFxUFlMPVQBfQVRXA1RWFlhcUlVfT1JaVgVWRwcxVlNRQlBYVVxUR1ReVTsOAxUeFF5JWBYZEEoKFBINSQcJGk4eFQsCAgIaFA%3D%3D
U402 U404 = NL17SZ17XV5T2G: Single Non‐Inverting Buffer / with Schmitt Trigger; Manufacturer: onsemi; Manufacturer Part Number: NL17SZ17XV5T2G; Supplier Link: https://www.mouser.com.tr/ProductDetail/onsemi/NL17SZ17XV5T2G?qs=8sOby8ZxZLFGwooP35NEMQ%3D%3D
U403 = S40FC004C1B2C00000: 4GB, 3.3 V, e.MMC Flash; Manufacturer: SkyHigh Memory; Manufacturer Part Number: S40FC004C1B2C00000; Supplier Link: https://www.mouser.com.tr/ProductDetail/SkyHigh-Memory/S40FC004C1B2C00000?qs=OlC7AqGiEDnnqQ4BF5kidg%3D%3D
X400 = ECS-2520MV-130-BN-TR: as X300 on sheet 3_ZynTra-Zynq-Config; Manufacturer Part Number: ECS-2520MV-130-BN-TR

## Sheet 5_ZynTra-Zynq-PL.SchDoc
size 304 x 228 mm; SheetNumber: 5; SheetTotal: 10
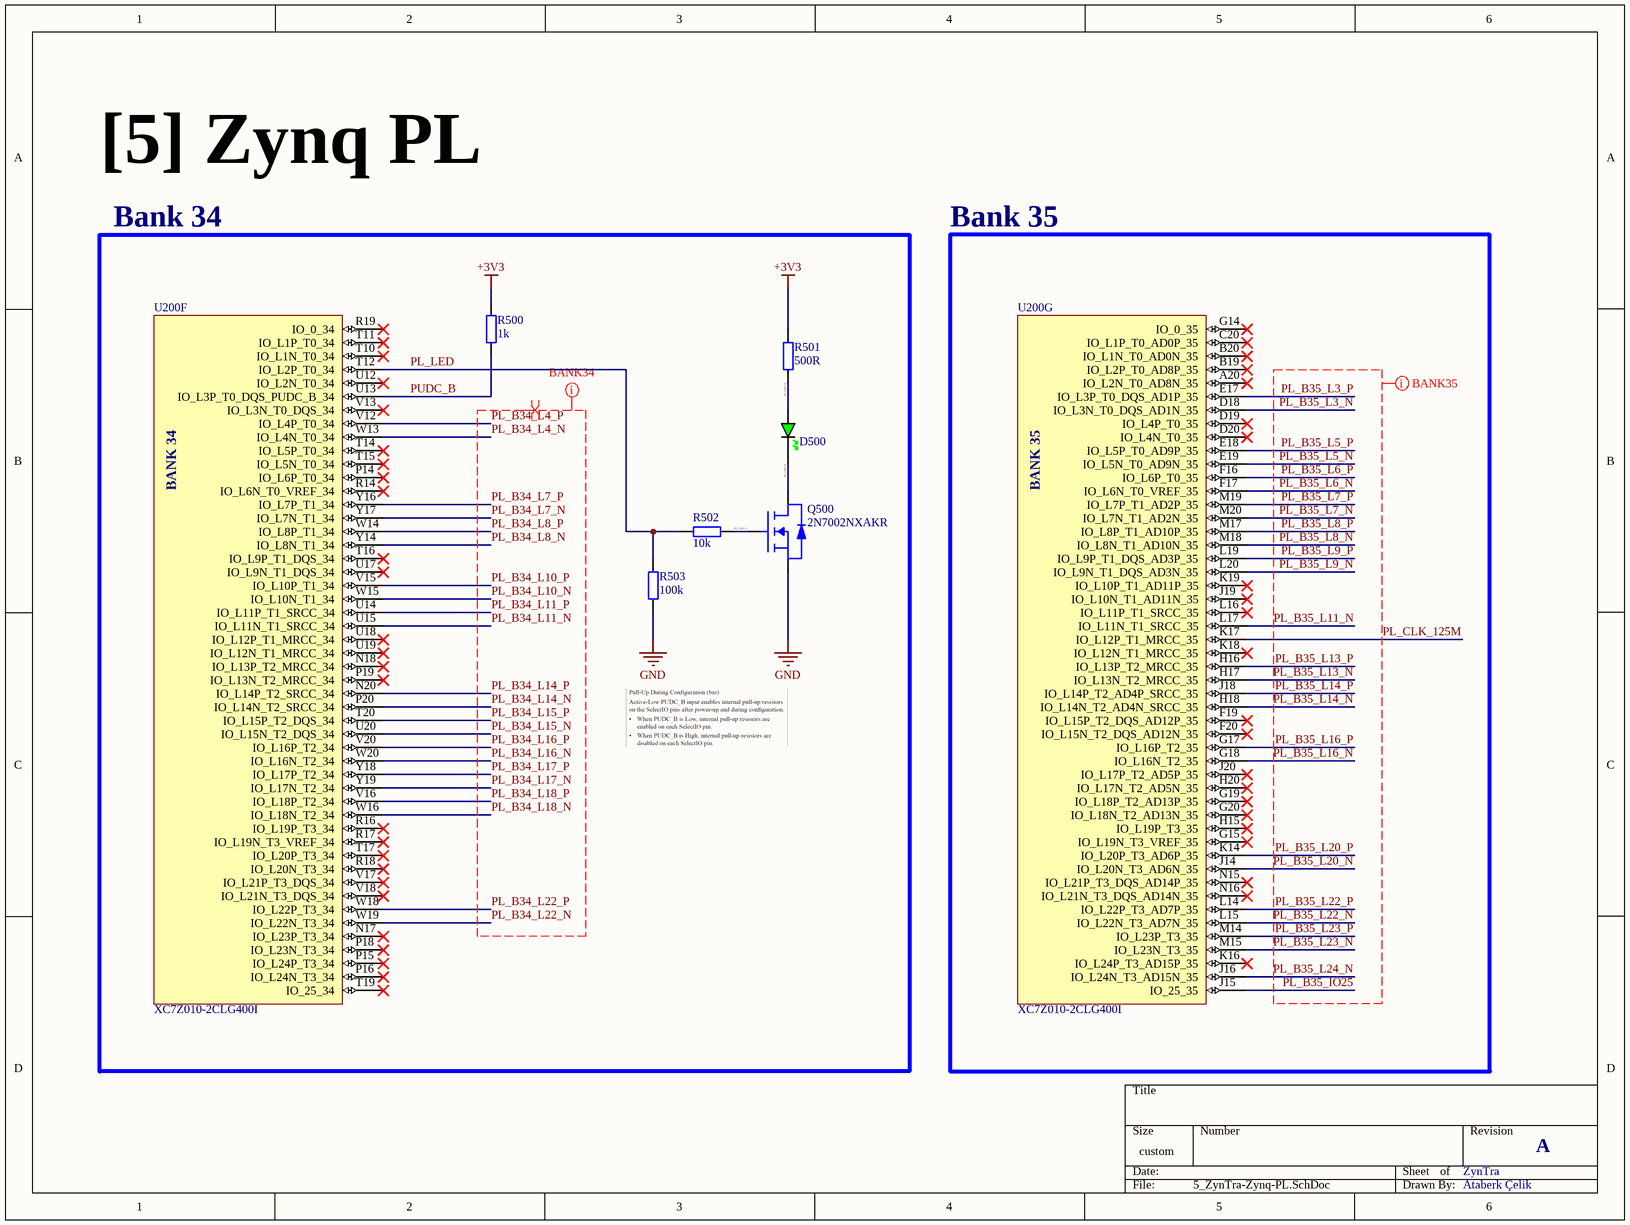
[diagram p4: 5_ZynTra-Zynq-PL.SchDoc]

### Parts
D500  GREEN  [LED_0603_GREEN]  (value not drawn)
Q500  2N7002NXAKR  [SSM3J338R,LF-SOT23-F]
R500  1k  [RES_0402]
R501  500R  [RES_0402]
R502  10k  [RES_0402]
R503  100k  [RES_0402]
U200  XC7Z010-2CLG400I  [CLG400, 0.8mm, 17x17]  (parts F,G of 9)

### Blocks framed on the sheet
Bank 34: D500 Q500 R500-R503 U200
Bank 35: U200

### Nets
+3V3: R500.1 R501.1
GND: Q500.S R503.2
PL_B34_L4_N: U200.W13(IO_L4N_T0_34)
PL_B34_L4_P: U200.V12(IO_L4P_T0_34)
PL_B34_L7_N: U200.Y17(IO_L7N_T1_34)
PL_B34_L7_P: U200.Y16(IO_L7P_T1_34)
PL_B34_L8_N: U200.Y14(IO_L8N_T1_34)
PL_B34_L8_P: U200.W14(IO_L8P_T1_34)
PL_B34_L10_N: U200.W15(IO_L10N_T1_34)
PL_B34_L10_P: U200.V15(IO_L10P_T1_34)
PL_B34_L11_N: U200.U15(IO_L11N_T1_SRCC_34)
PL_B34_L11_P: U200.U14(IO_L11P_T1_SRCC_34)
PL_B34_L14_N: U200.P20(IO_L14N_T2_SRCC_34)
PL_B34_L14_P: U200.N20(IO_L14P_T2_SRCC_34)
PL_B34_L15_N: U200.U20(IO_L15N_T2_DQS_34)
PL_B34_L15_P: U200.T20(IO_L15P_T2_DQS_34)
PL_B34_L16_N: U200.W20(IO_L16N_T2_34)
PL_B34_L16_P: U200.V20(IO_L16P_T2_34)
PL_B34_L17_N: U200.Y19(IO_L17N_T2_34)
PL_B34_L17_P: U200.Y18(IO_L17P_T2_34)
PL_B34_L18_N: U200.W16(IO_L18N_T2_34)
PL_B34_L18_P: U200.V16(IO_L18P_T2_34)
PL_B34_L22_N: U200.W19(IO_L22N_T3_34)
PL_B34_L22_P: U200.W18(IO_L22P_T3_34)
PL_B35_IO25: U200.J15(IO_25_35)
PL_B35_L3_N: U200.D18(IO_L3N_T0_DQS_AD1N_35)
PL_B35_L3_P: U200.E17(IO_L3P_T0_DQS_AD1P_35)
PL_B35_L5_N: U200.E19(IO_L5N_T0_AD9N_35)
PL_B35_L5_P: U200.E18(IO_L5P_T0_AD9P_35)
PL_B35_L6_N: U200.F17(IO_L6N_T0_VREF_35)
PL_B35_L6_P: U200.F16(IO_L6P_T0_35)
PL_B35_L7_N: U200.M20(IO_L7N_T1_AD2N_35)
PL_B35_L7_P: U200.M19(IO_L7P_T1_AD2P_35)
PL_B35_L8_N: U200.M18(IO_L8N_T1_AD10N_35)
PL_B35_L8_P: U200.M17(IO_L8P_T1_AD10P_35)
PL_B35_L9_N: U200.L20(IO_L9N_T1_DQS_AD3N_35)
PL_B35_L9_P: U200.L19(IO_L9P_T1_DQS_AD3P_35)
PL_B35_L11_N: U200.L17(IO_L11N_T1_SRCC_35)
PL_B35_L13_N: U200.H17(IO_L13N_T2_MRCC_35)
PL_B35_L13_P: U200.H16(IO_L13P_T2_MRCC_35)
PL_B35_L14_N: U200.H18(IO_L14N_T2_AD4N_SRCC_35)
PL_B35_L14_P: U200.J18(IO_L14P_T2_AD4P_SRCC_35)
PL_B35_L16_N: U200.G18(IO_L16N_T2_35)
PL_B35_L16_P: U200.G17(IO_L16P_T2_35)
PL_B35_L20_N: U200.J14(IO_L20N_T3_AD6N_35)
PL_B35_L20_P: U200.K14(IO_L20P_T3_AD6P_35)
PL_B35_L22_N: U200.L15(IO_L22N_T3_AD7N_35)
PL_B35_L22_P: U200.L14(IO_L22P_T3_AD7P_35)
PL_B35_L23_N: U200.M15(IO_L23N_T3_35)
PL_B35_L23_P: U200.M14(IO_L23P_T3_35)
PL_B35_L24_N: U200.J16(IO_L24N_T3_AD15N_35)
PL_CLK_125M: U200.K17(IO_L12P_T1_MRCC_35)
PL_LED: R502.1 R503.1 U200.T12(IO_L2P_T0_34)
PL_LED_A: D500.A R501.2
PL_LED_G: Q500.G R502.2
PL_LED_K: D500.K Q500.D
PUDC_B: R500.2 U200.U13(IO_L3P_T0_DQS_PUDC_B_34)

Not connected (* = marked no-connect by the designer): U200 A20(IO_L2N_T0_AD8N_35)* B19(IO_L2P_T0_AD8P_35)* B20(IO_L1N_T0_AD0N_35)* C20(IO_L1P_T0_AD0P_35)* D19(IO_L4P_T0_35)* D20(IO_L4N_T0_35)* F19(IO_L15P_T2_DQS_AD12P_35)* F20(IO_L15N_T2_DQS_AD12N_35)* G14(IO_0_35)* G15(IO_L19N_T3_VREF_35)* G19(IO_L18P_T2_AD13P_35)* G20(IO_L18N_T2_AD13N_35)* H15(IO_L19P_T3_35)* H20(IO_L17N_T2_AD5N_35)* J19(IO_L10N_T1_AD11N_35)* J20(IO_L17P_T2_AD5P_35)* K16(IO_L24P_T3_AD15P_35)* K18(IO_L12N_T1_MRCC_35)* K19(IO_L10P_T1_AD11P_35)* L16(IO_L11P_T1_SRCC_35)* N15(IO_L21P_T3_DQS_AD14P_35)* N16(IO_L21N_T3_DQS_AD14N_35)* N17(IO_L23P_T3_34)* N18(IO_L13P_T2_MRCC_34)* P14(IO_L6P_T0_34)* P15(IO_L24P_T3_34)* P16(IO_L24N_T3_34)* P18(IO_L23N_T3_34)* P19(IO_L13N_T2_MRCC_34)* R14(IO_L6N_T0_VREF_34)* R16(IO_L19P_T3_34)* R17(IO_L19N_T3_VREF_34)* R18(IO_L20N_T3_34)* R19(IO_0_34)* T10(IO_L1N_T0_34)* T11(IO_L1P_T0_34)* T14(IO_L5P_T0_34)* T15(IO_L5N_T0_34)* T16(IO_L9P_T1_DQS_34)* T17(IO_L20P_T3_34)* T19(IO_25_34)* U12(IO_L2N_T0_34)* U17(IO_L9N_T1_DQS_34)* U18(IO_L12P_T1_MRCC_34)* U19(IO_L12N_T1_MRCC_34)* V13(IO_L3N_T0_DQS_34)* V17(IO_L21P_T3_DQS_34)* V18(IO_L21N_T3_DQS_34)*

### Layout directives
net class BANK35: PL_B35_IO25, PL_B35_L3_N, PL_B35_L3_P, PL_B35_L5_N, PL_B35_L5_P, PL_B35_L6_N, PL_B35_L6_P, PL_B35_L7_N, PL_B35_L7_P, PL_B35_L8_N, PL_B35_L8_P, PL_B35_L9_N, PL_B35_L9_P, PL_B35_L11_N, PL_B35_L13_N, PL_B35_L13_P, PL_B35_L14_N, PL_B35_L14_P, PL_B35_L16_N, PL_B35_L16_P, PL_B35_L20_N, PL_B35_L20_P, PL_B35_L22_N, PL_B35_L22_P, PL_B35_L23_N, PL_B35_L23_P, PL_B35_L24_N
net class BANK34; rule Matched Net Lengths [Delay Tolerance = 10ps]: PL_B34_L4_N, PL_B34_L4_P, PL_B34_L7_N, PL_B34_L7_P, PL_B34_L8_N, PL_B34_L8_P, PL_B34_L10_N, PL_B34_L10_P, PL_B34_L11_N, PL_B34_L11_P, PL_B34_L14_N, PL_B34_L14_P, PL_B34_L15_N, PL_B34_L15_P, PL_B34_L16_N, PL_B34_L16_P, PL_B34_L17_N, PL_B34_L17_P, PL_B34_L18_N, PL_B34_L18_P, PL_B34_L22_N, PL_B34_L22_P
differential pair: PL_B34_L4_N, PL_B34_L4_P, PL_B34_L7_N, PL_B34_L7_P, PL_B34_L8_N, PL_B34_L8_P, PL_B34_L10_N, PL_B34_L10_P, PL_B34_L11_N, PL_B34_L11_P, PL_B34_L14_N, PL_B34_L14_P, PL_B34_L15_N, PL_B34_L15_P, PL_B34_L16_N, PL_B34_L16_P, PL_B34_L17_N, PL_B34_L17_P, PL_B34_L18_N, PL_B34_L18_P, PL_B34_L22_N, PL_B34_L22_P

### Notes on the sheet
- [5] Zynq PL
- ZynTra
- A
- Ataberk Çelik
- (in symbol XC7Z010-2CLG400I, part F) BANK 34
- (in symbol XC7Z010-2CLG400I, part G) BANK 35

### Library data of the parts
D500 = LED_0603_GREEN: LED 0603 GREEN SMD
Q500 = 2N7002NXAKR: as Q100 on sheet 1_ZynTra-Power; Manufacturer Part Number: 2N7002NXAKR
R500-R503 = RES_0402: Resistor SMD 0402; Manufacturer: *; Manufacturer Part Number: *; Distributor Link: *; LCSC: *
U200 = XC7Z010-2CLG400I: as U200 on sheet 2_ZynTra-Zynq-Power; Manufacturer Part Number: XC7Z010-2CLG400I; Supplier Link: https://www.mouser.com.tr/ProductDetail/AMD-Xilinx/XC7Z010-2CLG400I?qs=rrS6PyfT74cETvLeyRFHTA%3D%3D

## Sheet 6_ZynTra-Zynq-DDR Interface.SchDoc
size 381 x 228 mm; SheetNumber: 6; SheetTotal: 10
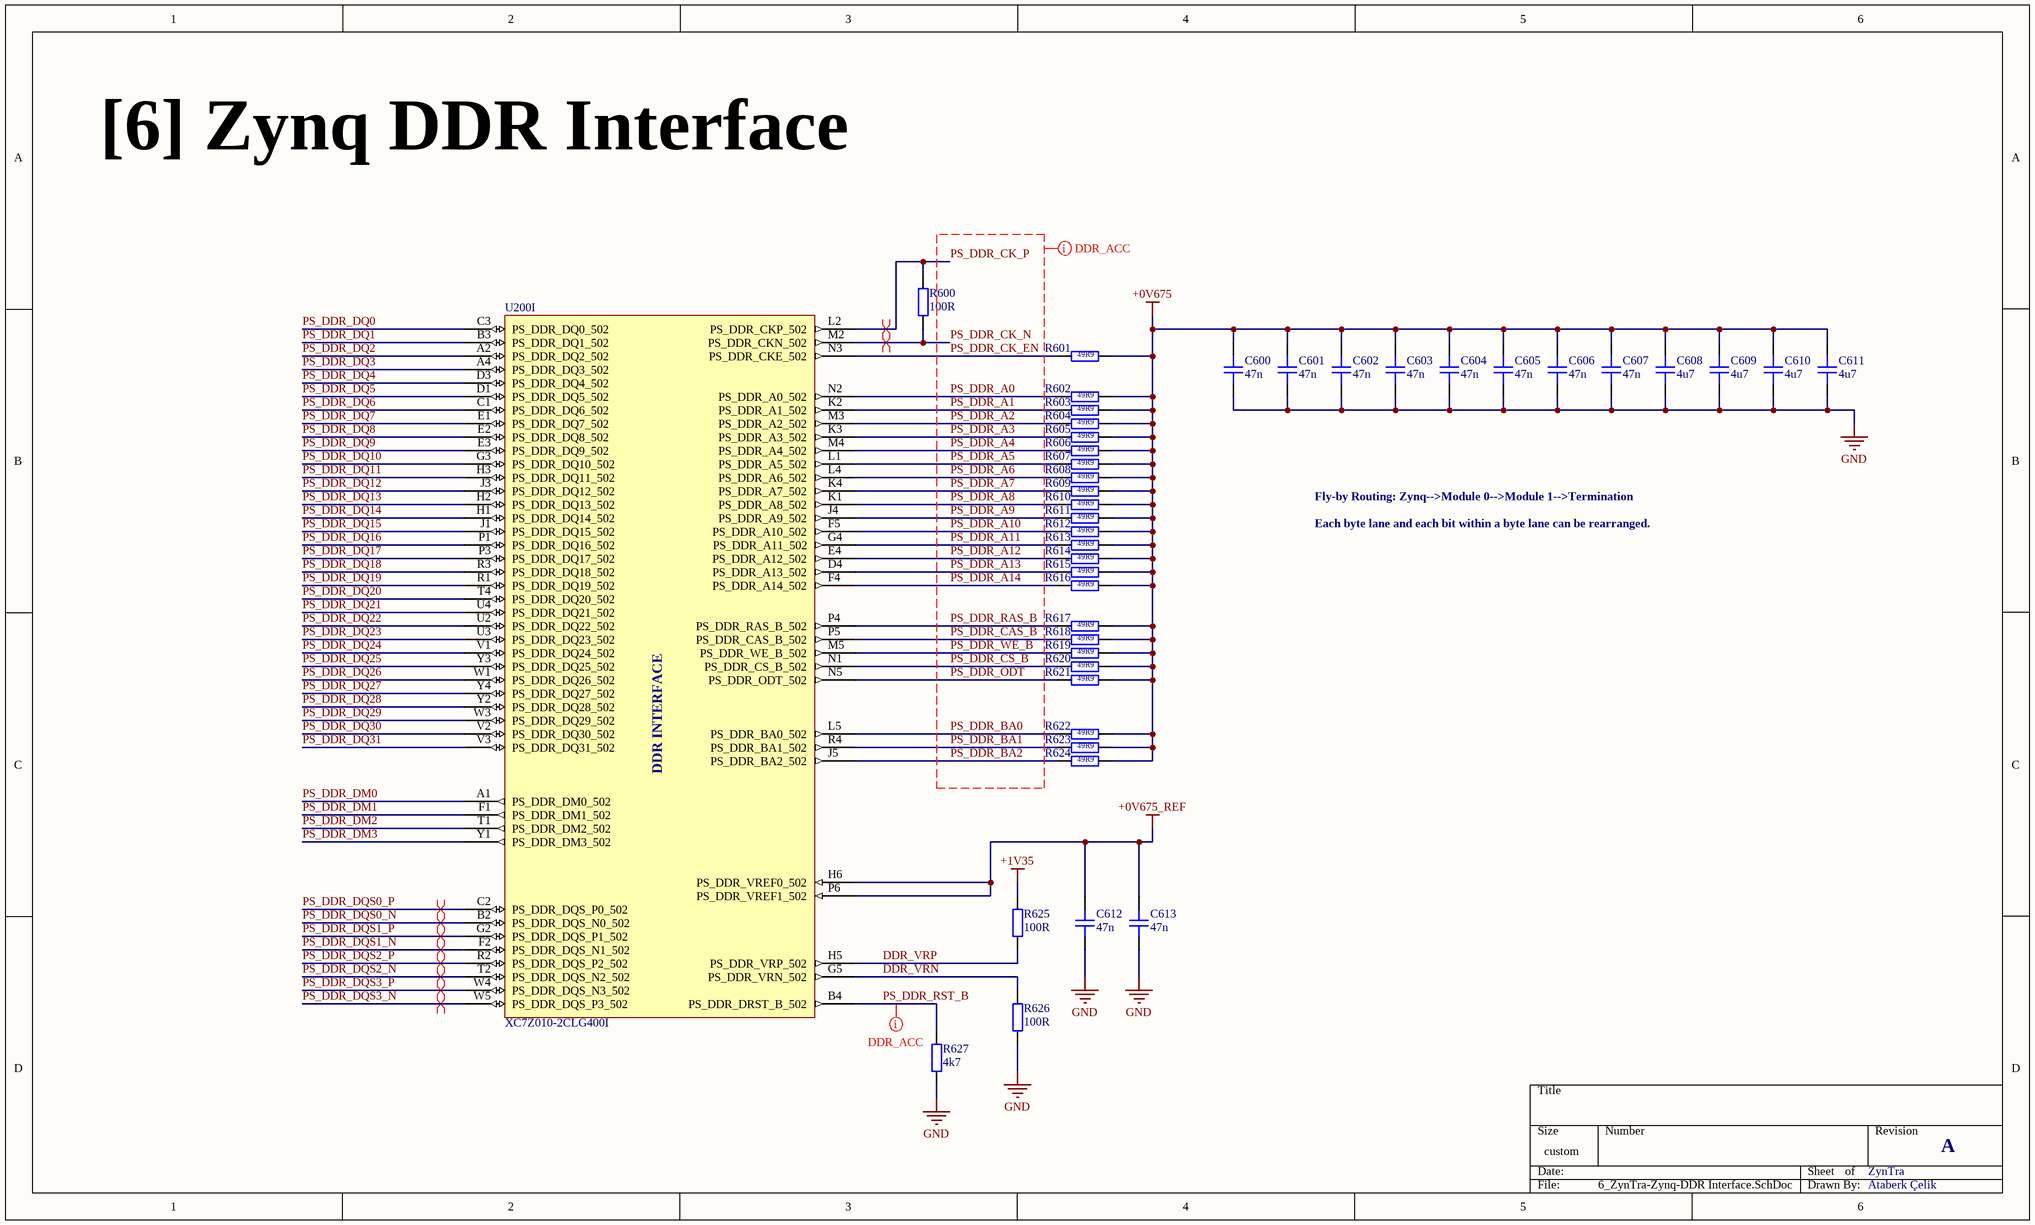
[diagram p5: 6_ZynTra-Zynq-DDR Interface.SchDoc]

### Parts
C600  47n  [CAP_0201]
C601  47n  [CAP_0201]
C602  47n  [CAP_0201]
C603  47n  [CAP_0201]
C604  47n  [CAP_0201]
C605  47n  [CAP_0201]
C606  47n  [CAP_0201]
C607  47n  [CAP_0201]
C608  4u7  [CAP_0402]
C609  4u7  [CAP_0402]
C610  4u7  [CAP_0402]
C611  4u7  [CAP_0402]
C612  47n  [CAP_0201]
C613  47n  [CAP_0201]
R600  100R  [RES_0201]
R601  49R9  [RES_0201]
R602  49R9  [RES_0201]
R603  49R9  [RES_0201]
R604  49R9  [RES_0201]
R605  49R9  [RES_0201]
R606  49R9  [RES_0201]
R607  49R9  [RES_0201]
R608  49R9  [RES_0201]
R609  49R9  [RES_0201]
R610  49R9  [RES_0201]
R611  49R9  [RES_0201]
R612  49R9  [RES_0201]
R613  49R9  [RES_0201]
R614  49R9  [RES_0201]
R615  49R9  [RES_0201]
R616  49R9  [RES_0201]
R617  49R9  [RES_0201]
R618  49R9  [RES_0201]
R619  49R9  [RES_0201]
R620  49R9  [RES_0201]
R621  49R9  [RES_0201]
R622  49R9  [RES_0201]
R623  49R9  [RES_0201]
R624  49R9  [RES_0201]
R625  100R  [RES_0201]
R626  100R  [RES_0201]
R627  4k7  [RES_0201]
U200  XC7Z010-2CLG400I  [CLG400, 0.8mm, 17x17]  (part I of 9)

### Nets
+0V675: C600.2 C601.2 C602.2 C603.2 C604.2 C605.2 C606.2 C607.2 C608.2 C609.2 C610.2 C611.2 R601.2 R602.2 R603.2 R604.2 R605.2 R606.2 R607.2 R608.2 R609.2 R610.2 R611.2 R612.2 R613.2 R614.2 R615.2 R616.2 R617.2 R618.2 R619.2 R620.2 R621.2 R622.2 R623.2 R624.2
+0V675_REF: C612.2 C613.2 U200.H6(PS_DDR_VREF0_502) U200.P6(PS_DDR_VREF1_502)
+1V35: R625.2
GND: C600.1 C601.1 C602.1 C603.1 C604.1 C605.1 C606.1 C607.1 C608.1 C609.1 C610.1 C611.1 C612.1 C613.1 R626.1 R627.1
DDR_VRN: R626.2 U200.G5(PS_DDR_VRN_502)
DDR_VRP: R625.1 U200.H5(PS_DDR_VRP_502)
PS_DDR_A0: R602.1 U200.N2(PS_DDR_A0_502)
PS_DDR_A1: R603.1 U200.K2(PS_DDR_A1_502)
PS_DDR_A2: R604.1 U200.M3(PS_DDR_A2_502)
PS_DDR_A3: R605.1 U200.K3(PS_DDR_A3_502)
PS_DDR_A4: R606.1 U200.M4(PS_DDR_A4_502)
PS_DDR_A5: R607.1 U200.L1(PS_DDR_A5_502)
PS_DDR_A6: R608.1 U200.L4(PS_DDR_A6_502)
PS_DDR_A7: R609.1 U200.K4(PS_DDR_A7_502)
PS_DDR_A8: R610.1 U200.K1(PS_DDR_A8_502)
PS_DDR_A9: R611.1 U200.J4(PS_DDR_A9_502)
PS_DDR_A10: R612.1 U200.F5(PS_DDR_A10_502)
PS_DDR_A11: R613.1 U200.G4(PS_DDR_A11_502)
PS_DDR_A12: R614.1 U200.E4(PS_DDR_A12_502)
PS_DDR_A13: R615.1 U200.D4(PS_DDR_A13_502)
PS_DDR_A14: R616.1 U200.F4(PS_DDR_A14_502)
PS_DDR_BA0: R622.1 U200.L5(PS_DDR_BA0_502)
PS_DDR_BA1: R623.1 U200.R4(PS_DDR_BA1_502)
PS_DDR_BA2: R624.1 U200.J5(PS_DDR_BA2_502)
PS_DDR_CAS_B: R618.1 U200.P5(PS_DDR_CAS_B_502)
PS_DDR_CK_EN: R601.1 U200.N3(PS_DDR_CKE_502)
PS_DDR_CK_N: R600.1 U200.M2(PS_DDR_CKN_502)
PS_DDR_CK_P: R600.2 U200.L2(PS_DDR_CKP_502)
PS_DDR_CS_B: R620.1 U200.N1(PS_DDR_CS_B_502)
PS_DDR_DM0: U200.A1(PS_DDR_DM0_502)
PS_DDR_DM1: U200.F1(PS_DDR_DM1_502)
PS_DDR_DM2: U200.T1(PS_DDR_DM2_502)
PS_DDR_DM3: U200.Y1(PS_DDR_DM3_502)
PS_DDR_DQ0: U200.C3(PS_DDR_DQ0_502)
PS_DDR_DQ1: U200.B3(PS_DDR_DQ1_502)
PS_DDR_DQ2: U200.A2(PS_DDR_DQ2_502)
PS_DDR_DQ3: U200.A4(PS_DDR_DQ3_502)
PS_DDR_DQ4: U200.D3(PS_DDR_DQ4_502)
PS_DDR_DQ5: U200.D1(PS_DDR_DQ5_502)
PS_DDR_DQ6: U200.C1(PS_DDR_DQ6_502)
PS_DDR_DQ7: U200.E1(PS_DDR_DQ7_502)
PS_DDR_DQ8: U200.E2(PS_DDR_DQ8_502)
PS_DDR_DQ9: U200.E3(PS_DDR_DQ9_502)
PS_DDR_DQ10: U200.G3(PS_DDR_DQ10_502)
PS_DDR_DQ11: U200.H3(PS_DDR_DQ11_502)
PS_DDR_DQ12: U200.J3(PS_DDR_DQ12_502)
PS_DDR_DQ13: U200.H2(PS_DDR_DQ13_502)
PS_DDR_DQ14: U200.H1(PS_DDR_DQ14_502)
PS_DDR_DQ15: U200.J1(PS_DDR_DQ15_502)
PS_DDR_DQ16: U200.P1(PS_DDR_DQ16_502)
PS_DDR_DQ17: U200.P3(PS_DDR_DQ17_502)
PS_DDR_DQ18: U200.R3(PS_DDR_DQ18_502)
PS_DDR_DQ19: U200.R1(PS_DDR_DQ19_502)
PS_DDR_DQ20: U200.T4(PS_DDR_DQ20_502)
PS_DDR_DQ21: U200.U4(PS_DDR_DQ21_502)
PS_DDR_DQ22: U200.U2(PS_DDR_DQ22_502)
PS_DDR_DQ23: U200.U3(PS_DDR_DQ23_502)
PS_DDR_DQ24: U200.V1(PS_DDR_DQ24_502)
PS_DDR_DQ25: U200.Y3(PS_DDR_DQ25_502)
PS_DDR_DQ26: U200.W1(PS_DDR_DQ26_502)
PS_DDR_DQ27: U200.Y4(PS_DDR_DQ27_502)
PS_DDR_DQ28: U200.Y2(PS_DDR_DQ28_502)
PS_DDR_DQ29: U200.W3(PS_DDR_DQ29_502)
PS_DDR_DQ30: U200.V2(PS_DDR_DQ30_502)
PS_DDR_DQ31: U200.V3(PS_DDR_DQ31_502)
PS_DDR_DQS0_N: U200.B2(PS_DDR_DQS_N0_502)
PS_DDR_DQS0_P: U200.C2(PS_DDR_DQS_P0_502)
PS_DDR_DQS1_N: U200.F2(PS_DDR_DQS_N1_502)
PS_DDR_DQS1_P: U200.G2(PS_DDR_DQS_P1_502)
PS_DDR_DQS2_N: U200.T2(PS_DDR_DQS_N2_502)
PS_DDR_DQS2_P: U200.R2(PS_DDR_DQS_P2_502)
PS_DDR_DQS3_N: U200.W5(PS_DDR_DQS_P3_502)
PS_DDR_DQS3_P: U200.W4(PS_DDR_DQS_N3_502)
PS_DDR_ODT: R621.1 U200.N5(PS_DDR_ODT_502)
PS_DDR_RAS_B: R617.1 U200.P4(PS_DDR_RAS_B_502)
PS_DDR_RST_B: R627.2 U200.B4(PS_DDR_DRST_B_502)
PS_DDR_WE_B: R619.1 U200.M5(PS_DDR_WE_B_502)

### Layout directives
differential pair: PS_DDR_CK_N, PS_DDR_CK_P, PS_DDR_DQS0_N, PS_DDR_DQS0_P, PS_DDR_DQS1_N, PS_DDR_DQS1_P, PS_DDR_DQS2_N, PS_DDR_DQS2_P, PS_DDR_DQS3_N, PS_DDR_DQS3_P
net class DDR_ACC; rule Matched Net Lengths [Delay Tolerance = 10ps]: PS_DDR_A0, PS_DDR_A1, PS_DDR_A2, PS_DDR_A3, PS_DDR_A4, PS_DDR_A5, PS_DDR_A6, PS_DDR_A7, PS_DDR_A8, PS_DDR_A9, PS_DDR_A10, PS_DDR_A11, PS_DDR_A12, PS_DDR_A13, PS_DDR_A14, PS_DDR_BA0, PS_DDR_BA1, PS_DDR_BA2, PS_DDR_CAS_B, PS_DDR_CK_EN, PS_DDR_CK_N, PS_DDR_CK_P, PS_DDR_CS_B, PS_DDR_ODT, PS_DDR_RAS_B, PS_DDR_RST_B, PS_DDR_WE_B

### Notes on the sheet
- [6] Zynq DDR Interface
- Fly-by Routing: Zynq-->Module 0-->Module 1-->Termination
- Each byte lane and each bit within a byte lane can be rearranged.
- ZynTra
- A
- Ataberk Çelik
- (in symbol XC7Z010-2CLG400I, part I) DDR INTERFACE

### Library data of the parts
C600-C607 C612 C613 = CAP_0201: Capacitor SMD 0201; Manufacturer: *; Manufacturer Part Number: *; Distributor Link: *; LCSC: *; Rating: *; Dielectric: *
C608-C611 = CAP_0402: Capacitor SMD 0402; Manufacturer: *; Manufacturer Part Number: *; Distributor Link: *; LCSC: *; Rating: *; Dielectric: *
R600-R627 = RES_0201: Resistor SMD 0201; Manufacturer: *; Manufacturer Part Number: *; Distributor Link: *; LCSC: *
U200 = XC7Z010-2CLG400I: as U200 on sheet 2_ZynTra-Zynq-Power; Manufacturer Part Number: XC7Z010-2CLG400I; Supplier Link: https://www.mouser.com.tr/ProductDetail/AMD-Xilinx/XC7Z010-2CLG400I?qs=rrS6PyfT74cETvLeyRFHTA%3D%3D

## Sheet 7_ZynTra-DDR3L Modules.SchDoc
size 508 x 279 mm; SheetNumber: 7; SheetTotal: 10
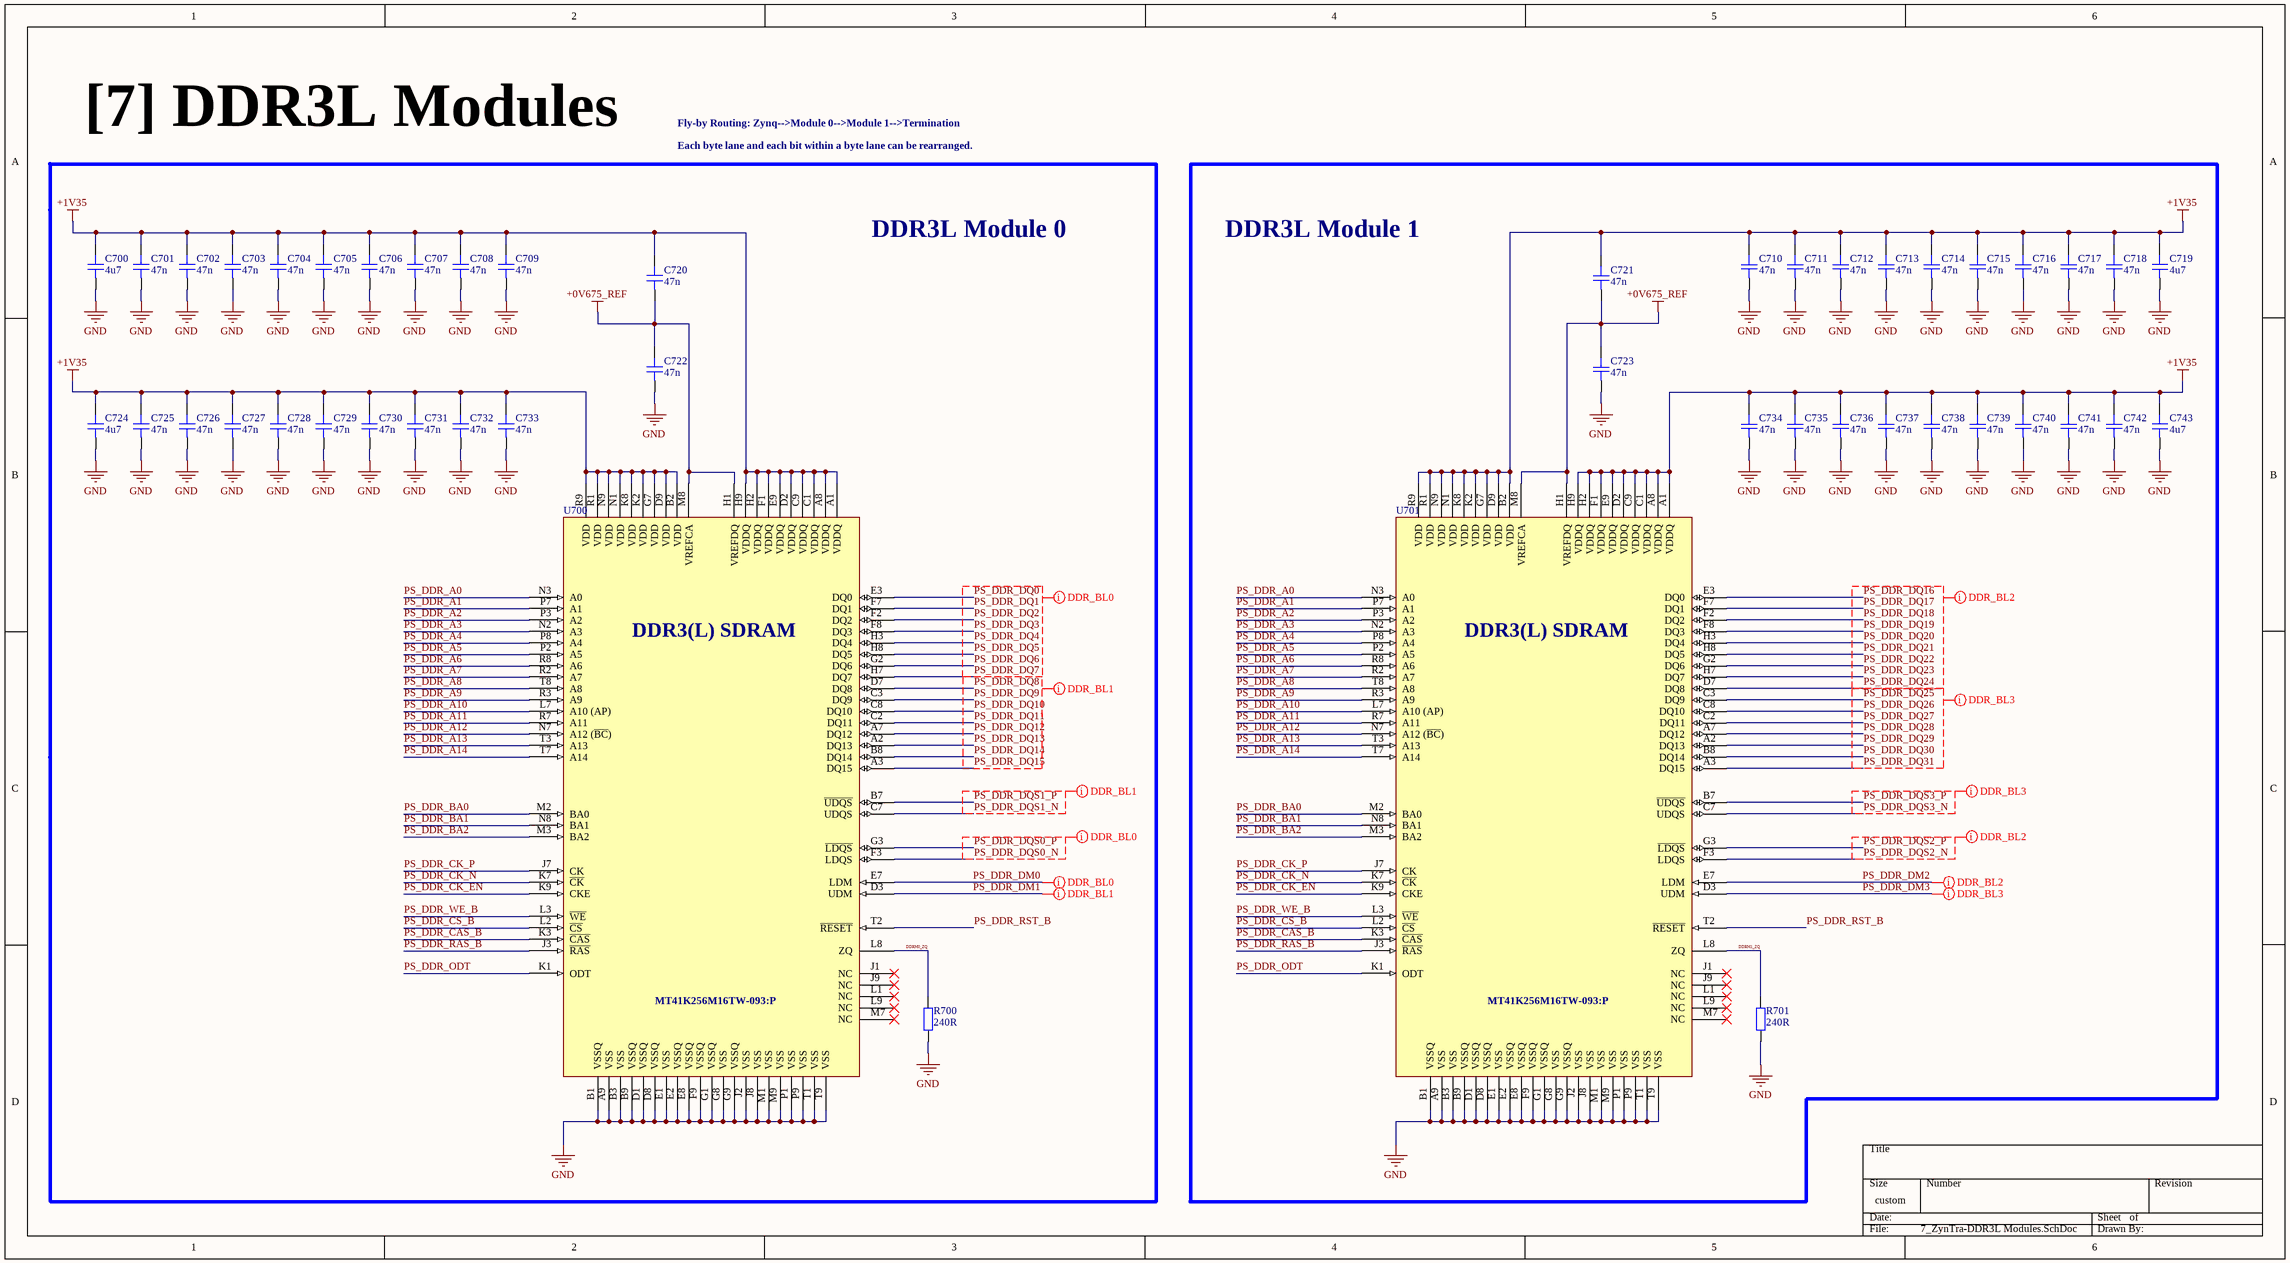
[diagram p6: 7_ZynTra-DDR3L Modules.SchDoc]

### Parts
C700  4u7  [CAP_0402]
C701  47n  [CAP_0201]
C702  47n  [CAP_0201]
C703  47n  [CAP_0201]
C704  47n  [CAP_0201]
C705  47n  [CAP_0201]
C706  47n  [CAP_0201]
C707  47n  [CAP_0201]
C708  47n  [CAP_0201]
C709  47n  [CAP_0201]
C710  47n  [CAP_0201]
C711  47n  [CAP_0201]
C712  47n  [CAP_0201]
C713  47n  [CAP_0201]
C714  47n  [CAP_0201]
C715  47n  [CAP_0201]
C716  47n  [CAP_0201]
C717  47n  [CAP_0201]
C718  47n  [CAP_0201]
C719  4u7  [CAP_0402]
C720  47n  [CAP_0201]
C721  47n  [CAP_0201]
C722  47n  [CAP_0201]
C723  47n  [CAP_0201]
C724  4u7  [CAP_0402]
C725  47n  [CAP_0201]
C726  47n  [CAP_0201]
C727  47n  [CAP_0201]
C728  47n  [CAP_0201]
C729  47n  [CAP_0201]
C730  47n  [CAP_0201]
C731  47n  [CAP_0201]
C732  47n  [CAP_0201]
C733  47n  [CAP_0201]
C734  47n  [CAP_0201]
C735  47n  [CAP_0201]
C736  47n  [CAP_0201]
C737  47n  [CAP_0201]
C738  47n  [CAP_0201]
C739  47n  [CAP_0201]
C740  47n  [CAP_0201]
C741  47n  [CAP_0201]
C742  47n  [CAP_0201]
C743  4u7  [CAP_0402]
R700  240R  [RES_0201]
R701  240R  [RES_0201]
U700  MT41K256M16TW-093:P  [96-BALL, FBGA, 0.8mm]
U701  MT41K256M16TW-093:P  [96-BALL, FBGA, 0.8mm]

### Blocks framed on the sheet
DDR3L Module 0: C700-C709 C720 C722 C724-C733 R700 U700
DDR3L Module 1: C710-C719 C721 C723 C734-C743 R701 U701

### Nets
+0V675_REF: C720.1 C721.1 C722.2 C723.2 U700.H1(VREFDQ) U700.M8(VREFCA) U701.H1(VREFDQ) U701.M8(VREFCA)
+1V35: C700.2 C701.2 C702.2 C703.2 C704.2 C705.2 C706.2 C707.2 C708.2 C709.2 C710.2 C711.2 C712.2 C713.2 C714.2 C715.2 C716.2 C717.2 C718.2 C719.2 C720.2 C721.2 C724.2 C725.2 C726.2 C727.2 C728.2 C729.2 C730.2 C731.2 C732.2 C733.2 C734.2 C735.2 C736.2 C737.2 C738.2 C739.2 C740.2 C741.2 C742.2 C743.2 U700.A1(VDDQ) U700.A8(VDDQ) U700.B2(VDD) U700.C1(VDDQ) U700.C9(VDDQ) U700.D2(VDDQ) U700.D9(VDD) U700.E9(VDDQ) U700.F1(VDDQ) U700.G7(VDD) U700.H2(VDDQ) U700.H9(VDDQ) U700.K2(VDD) U700.K8(VDD) U700.N1(VDD) U700.N9(VDD) U700.R1(VDD) U700.R9(VDD) U701.A1(VDDQ) U701.A8(VDDQ) U701.B2(VDD) U701.C1(VDDQ) U701.C9(VDDQ) U701.D2(VDDQ) U701.D9(VDD) U701.E9(VDDQ) U701.F1(VDDQ) U701.G7(VDD) U701.H2(VDDQ) U701.H9(VDDQ) U701.K2(VDD) U701.K8(VDD) U701.N1(VDD) U701.N9(VDD) U701.R1(VDD) U701.R9(VDD)
GND: C700.1 C701.1 C702.1 C703.1 C704.1 C705.1 C706.1 C707.1 C708.1 C709.1 C710.1 C711.1 C712.1 C713.1 C714.1 C715.1 C716.1 C717.1 C718.1 C719.1 C722.1 C723.1 C724.1 C725.1 C726.1 C727.1 C728.1 C729.1 C730.1 C731.1 C732.1 C733.1 C734.1 C735.1 C736.1 C737.1 C738.1 C739.1 C740.1 C741.1 C742.1 C743.1 R700.1 R701.1 U700.A9(VSS) U700.B1(VSSQ) U700.B3(VSS) U700.B9(VSSQ) U700.D1(VSSQ) U700.D8(VSSQ) U700.E1(VSS) U700.E2(VSSQ) U700.E8(VSSQ) U700.F9(VSSQ) U700.G1(VSSQ) U700.G8(VSS) U700.G9(VSSQ) U700.J2(VSS) U700.J8(VSS) U700.M1(VSS) U700.M9(VSS) U700.P1(VSS) U700.P9(VSS) U700.T1(VSS) U700.T9(VSS) U701.A9(VSS) U701.B1(VSSQ) U701.B3(VSS) U701.B9(VSSQ) U701.D1(VSSQ) U701.D8(VSSQ) U701.E1(VSS) U701.E2(VSSQ) U701.E8(VSSQ) U701.F9(VSSQ) U701.G1(VSSQ) U701.G8(VSS) U701.G9(VSSQ) U701.J2(VSS) U701.J8(VSS) U701.M1(VSS) U701.M9(VSS) U701.P1(VSS) U701.P9(VSS) U701.T1(VSS) U701.T9(VSS)
DDRM0_ZQ: R700.2 U700.L8(ZQ)
DDRM1_ZQ: R701.2 U701.L8(ZQ)
PS_DDR_A0: U700.N3(A0) U701.N3(A0)
PS_DDR_A1: U700.P7(A1) U701.P7(A1)
PS_DDR_A2: U700.P3(A2) U701.P3(A2)
PS_DDR_A3: U700.N2(A3) U701.N2(A3)
PS_DDR_A4: U700.P8(A4) U701.P8(A4)
PS_DDR_A5: U700.P2(A5) U701.P2(A5)
PS_DDR_A6: U700.R8(A6) U701.R8(A6)
PS_DDR_A7: U700.R2(A7) U701.R2(A7)
PS_DDR_A8: U700.T8(A8) U701.T8(A8)
PS_DDR_A9: U700.R3(A9) U701.R3(A9)
PS_DDR_A10: U700.L7(A10_(AP)) U701.L7(A10_(AP))
PS_DDR_A11: U700.R7(A11) U701.R7(A11)
PS_DDR_A12: U700.N7(A12_(~{BC})) U701.N7(A12_(~{BC}))
PS_DDR_A13: U700.T3(A13) U701.T3(A13)
PS_DDR_A14: U700.T7(A14) U701.T7(A14)
PS_DDR_BA0: U700.M2(BA0) U701.M2(BA0)
PS_DDR_BA1: U700.N8(BA1) U701.N8(BA1)
PS_DDR_BA2: U700.M3(BA2) U701.M3(BA2)
PS_DDR_CAS_B: U700.K3(~{CAS}) U701.K3(~{CAS})
PS_DDR_CK_EN: U700.K9(CKE) U701.K9(CKE)
PS_DDR_CK_N: U700.K7(~{CK}) U701.K7(~{CK})
PS_DDR_CK_P: U700.J7(CK) U701.J7(CK)
PS_DDR_CS_B: U700.L2(~{CS}) U701.L2(~{CS})
PS_DDR_DM0: U700.E7(LDM)
PS_DDR_DM1: U700.D3(UDM)
PS_DDR_DM2: U701.E7(LDM)
PS_DDR_DM3: U701.D3(UDM)
PS_DDR_DQ0: U700.E3(DQ0)
PS_DDR_DQ1: U700.F7(DQ1)
PS_DDR_DQ2: U700.F2(DQ2)
PS_DDR_DQ3: U700.F8(DQ3)
PS_DDR_DQ4: U700.H3(DQ4)
PS_DDR_DQ5: U700.H8(DQ5)
PS_DDR_DQ6: U700.G2(DQ6)
PS_DDR_DQ7: U700.H7(DQ7)
PS_DDR_DQ8: U700.D7(DQ8)
PS_DDR_DQ9: U700.C3(DQ9)
PS_DDR_DQ10: U700.C8(DQ10)
PS_DDR_DQ11: U700.C2(DQ11)
PS_DDR_DQ12: U700.A7(DQ12)
PS_DDR_DQ13: U700.A2(DQ13)
PS_DDR_DQ14: U700.B8(DQ14)
PS_DDR_DQ15: U700.A3(DQ15)
PS_DDR_DQ16: U701.E3(DQ0)
PS_DDR_DQ17: U701.F7(DQ1)
PS_DDR_DQ18: U701.F2(DQ2)
PS_DDR_DQ19: U701.F8(DQ3)
PS_DDR_DQ20: U701.H3(DQ4)
PS_DDR_DQ21: U701.H8(DQ5)
PS_DDR_DQ22: U701.G2(DQ6)
PS_DDR_DQ23: U701.H7(DQ7)
PS_DDR_DQ24: U701.D7(DQ8)
PS_DDR_DQ25: U701.C3(DQ9)
PS_DDR_DQ26: U701.C8(DQ10)
PS_DDR_DQ27: U701.C2(DQ11)
PS_DDR_DQ28: U701.A7(DQ12)
PS_DDR_DQ29: U701.A2(DQ13)
PS_DDR_DQ30: U701.B8(DQ14)
PS_DDR_DQ31: U701.A3(DQ15)
PS_DDR_DQS0_N: U700.F3(LDQS)
PS_DDR_DQS0_P: U700.G3(~{LDQS})
PS_DDR_DQS1_N: U700.C7(UDQS)
PS_DDR_DQS1_P: U700.B7(~{UDQS})
PS_DDR_DQS2_N: U701.F3(LDQS)
PS_DDR_DQS2_P: U701.G3(~{LDQS})
PS_DDR_DQS3_N: U701.C7(UDQS)
PS_DDR_DQS3_P: U701.B7(~{UDQS})
PS_DDR_ODT: U700.K1(ODT) U701.K1(ODT)
PS_DDR_RAS_B: U700.J3(~{RAS}) U701.J3(~{RAS})
PS_DDR_RST_B: U700.T2(~{RESET}) U701.T2(~{RESET})
PS_DDR_WE_B: U700.L3(~{WE}) U701.L3(~{WE})

Not connected (* = marked no-connect by the designer): U700 J1(NC)* J9(NC)* L1(NC)* L9(NC)* M7(NC)*; U701 J1(NC)* J9(NC)* L1(NC)* L9(NC)* M7(NC)*

### Layout directives
net class DDR_BL0; rule Matched Net Lengths [Delay Tolerance = 10ps]: PS_DDR_DM0, PS_DDR_DQ0, PS_DDR_DQ1, PS_DDR_DQ2, PS_DDR_DQ3, PS_DDR_DQ4, PS_DDR_DQ5, PS_DDR_DQ6, PS_DDR_DQ7, PS_DDR_DQS0_N, PS_DDR_DQS0_P
net class DDR_BL1; rule Matched Net Lengths [Delay Tolerance = 10ps]: PS_DDR_DM1, PS_DDR_DQ7, PS_DDR_DQ8, PS_DDR_DQ9, PS_DDR_DQ10, PS_DDR_DQ11, PS_DDR_DQ12, PS_DDR_DQ13, PS_DDR_DQ14, PS_DDR_DQ15, PS_DDR_DQS1_N, PS_DDR_DQS1_P
net class DDR_BL2; rule Matched Net Lengths [Delay Tolerance = 10ps]: PS_DDR_DM2, PS_DDR_DQ16, PS_DDR_DQ17, PS_DDR_DQ18, PS_DDR_DQ19, PS_DDR_DQ20, PS_DDR_DQ21, PS_DDR_DQ22, PS_DDR_DQ23, PS_DDR_DQ24, PS_DDR_DQS2_N, PS_DDR_DQS2_P
rule Matched Net Lengths [Delay Tolerance = 10ps]; net class DDR_BL3: PS_DDR_DM3, PS_DDR_DQ24, PS_DDR_DQ25, PS_DDR_DQ26, PS_DDR_DQ27, PS_DDR_DQ28, PS_DDR_DQ29, PS_DDR_DQ30, PS_DDR_DQ31, PS_DDR_DQS3_N, PS_DDR_DQS3_P

### Notes on the sheet
- [7] DDR3L Modules
- Fly-by Routing: Zynq-->Module 0-->Module 1-->Termination
- Each byte lane and each bit within a byte lane can be rearranged.
- (in symbol MT41K256M16TW-093:P) DDR3(L) SDRAM

### Library data of the parts
C700 C719 C724 C743 = CAP_0402: Capacitor SMD 0402; Manufacturer: *; Manufacturer Part Number: *; Distributor Link: *; LCSC: *; Rating: *; Dielectric: *
C701-C718 C720-C723 C725-C742 = CAP_0201: Capacitor SMD 0201; Manufacturer: *; Manufacturer Part Number: *; Distributor Link: *; LCSC: *; Rating: *; Dielectric: *
R700 R701 = RES_0201: Resistor SMD 0201; Manufacturer: *; Manufacturer Part Number: *; Distributor Link: *; LCSC: *
U700 U701 = MT41K256M16TW-093:P: DDR3L SDRAM; Manufacturer: Micron Technology; Manufacturer Part Number: MT41K256M16TW-093:P; Supplier Link: https://www.mouser.com.tr/ProductDetail/Micron/MT41K256M16TW-093P?qs=rrS6PyfT74eBsDr2Pdy9oQ%3D%3D